# EasyEDA Pro project ProProject_OSC_Ver0.2_2023-11-09.epro, schematic MainBoard

## Sheets
1 Power: Create Date: 2023-09-10; Page Name: Power; Project Name: OSC_Ver0.2; Schematic Name: MainBoard; Update Date: 2023-11-07; Company: 嘉立创EDA; Page Size: A4; Version: V1.0
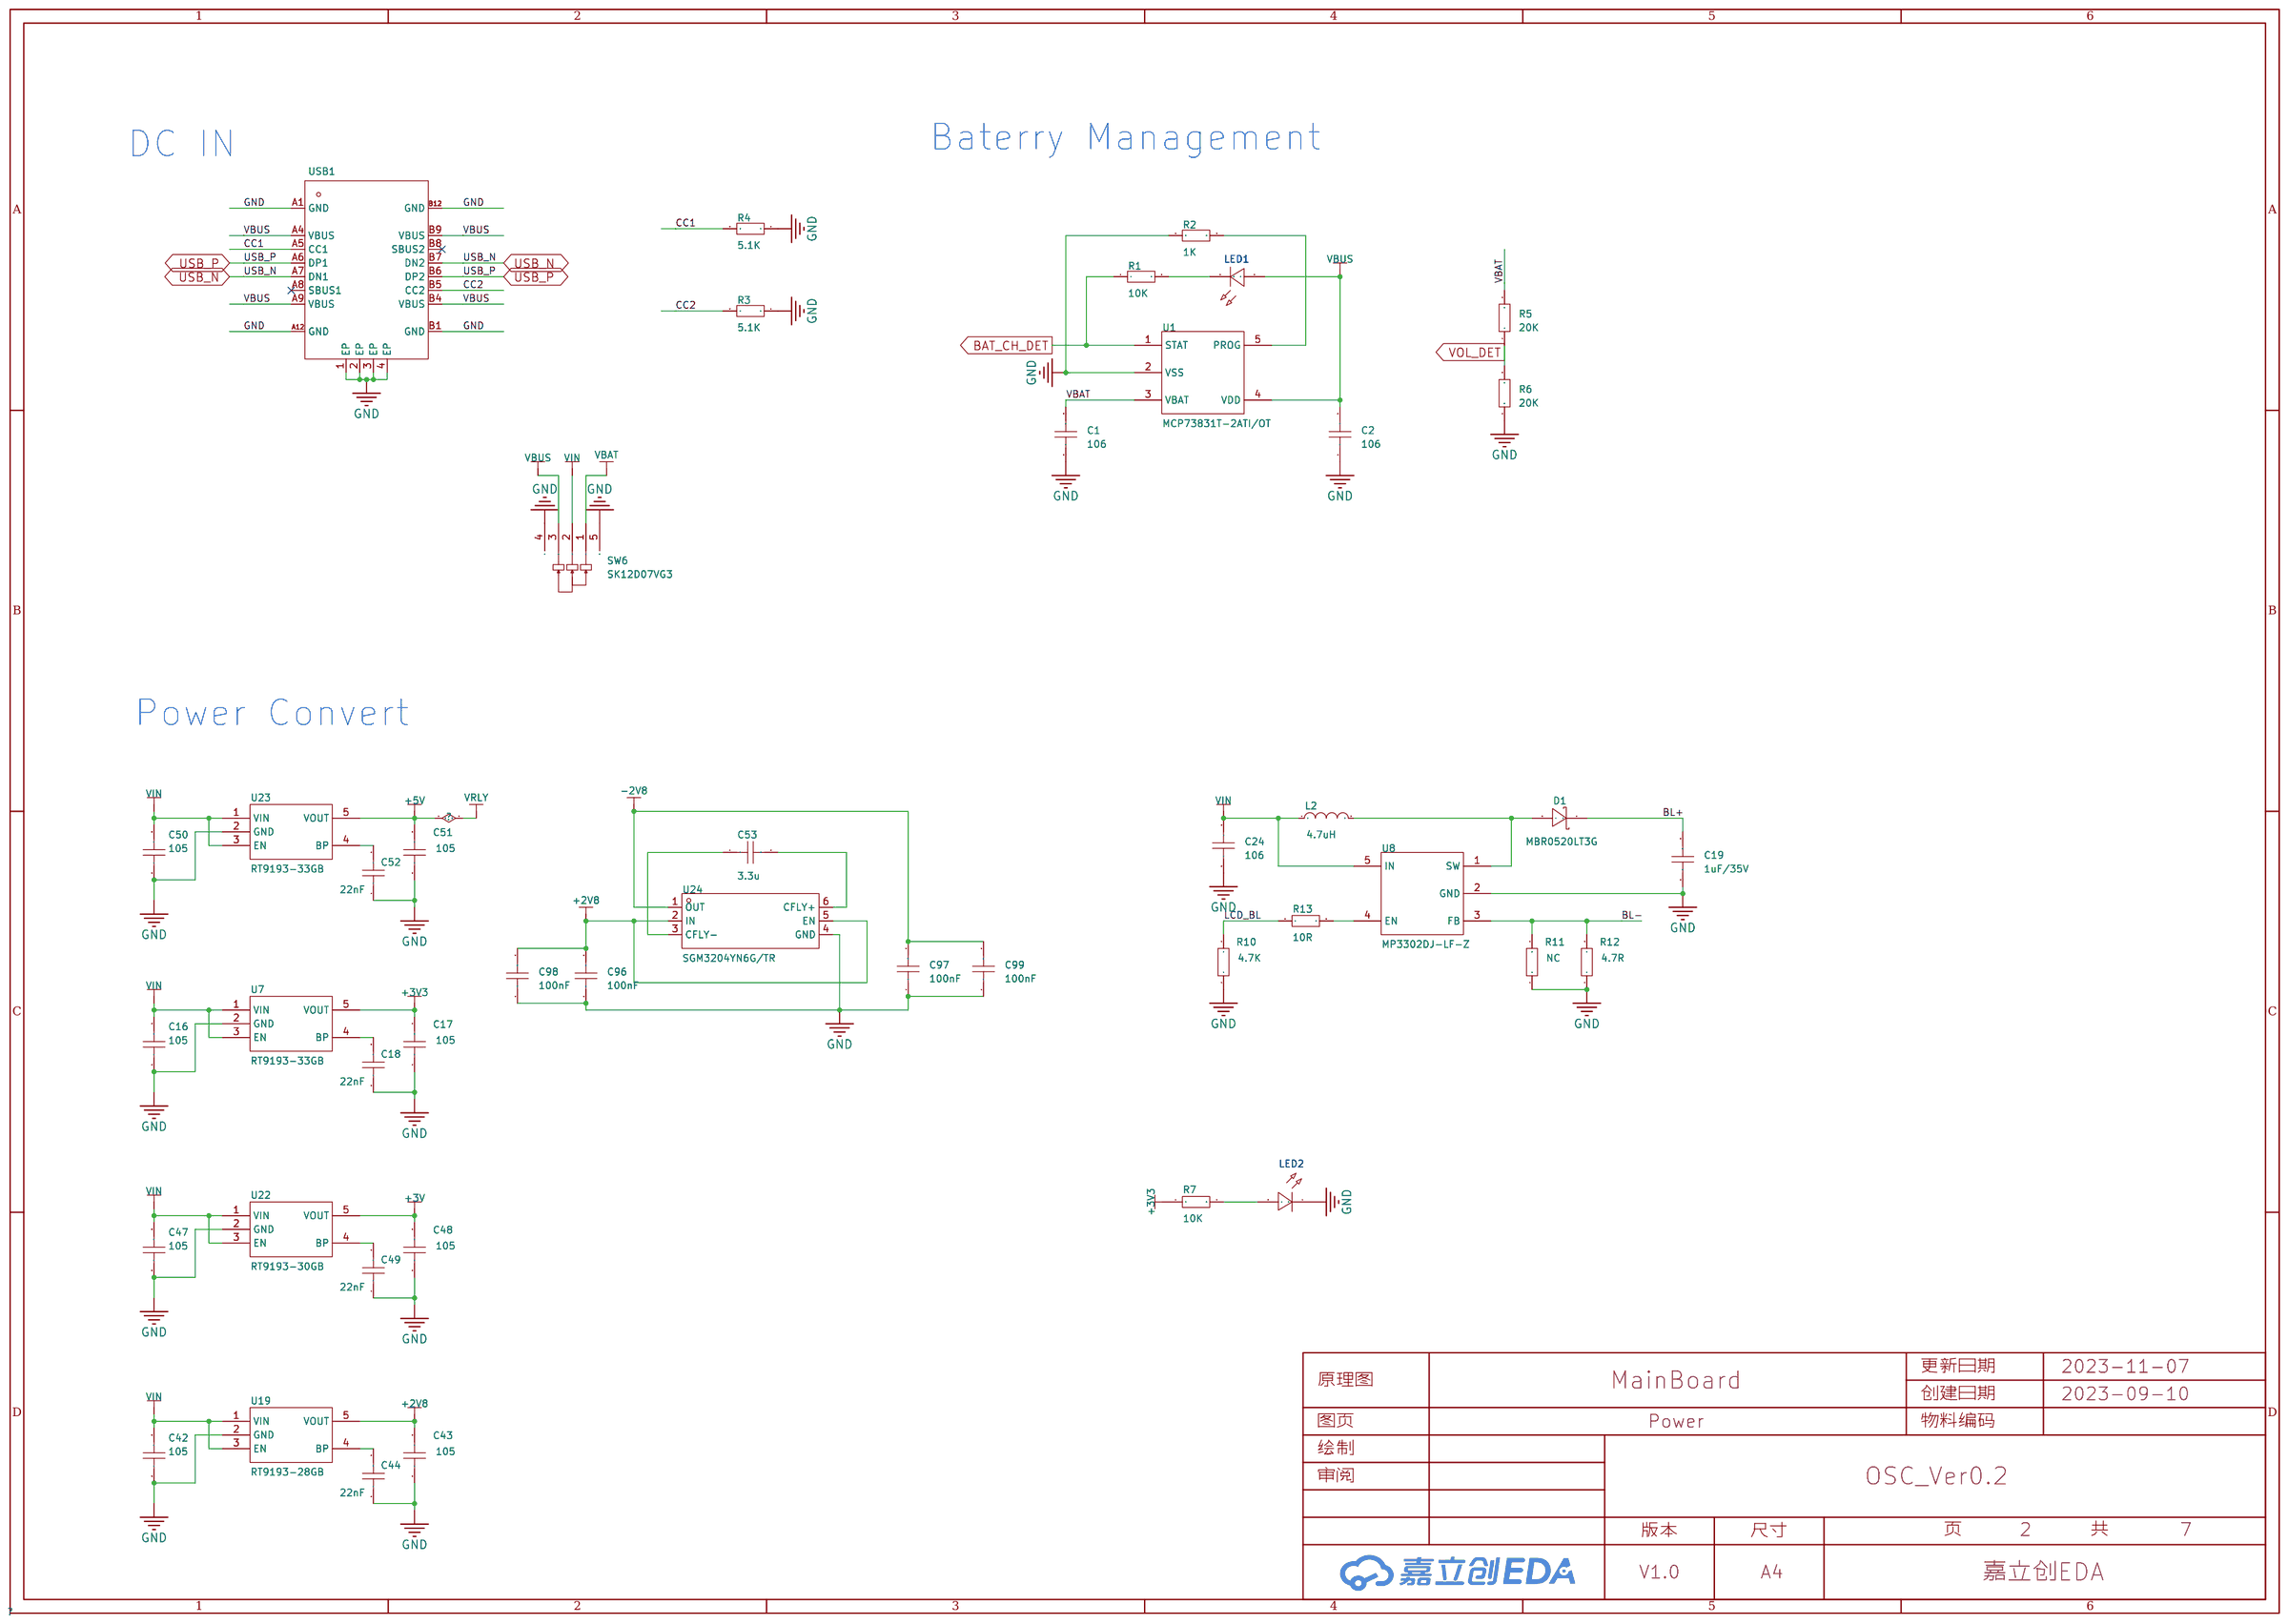
[diagram p1: Power]
2 MCU: Page Name: MCU; Page Size: A3
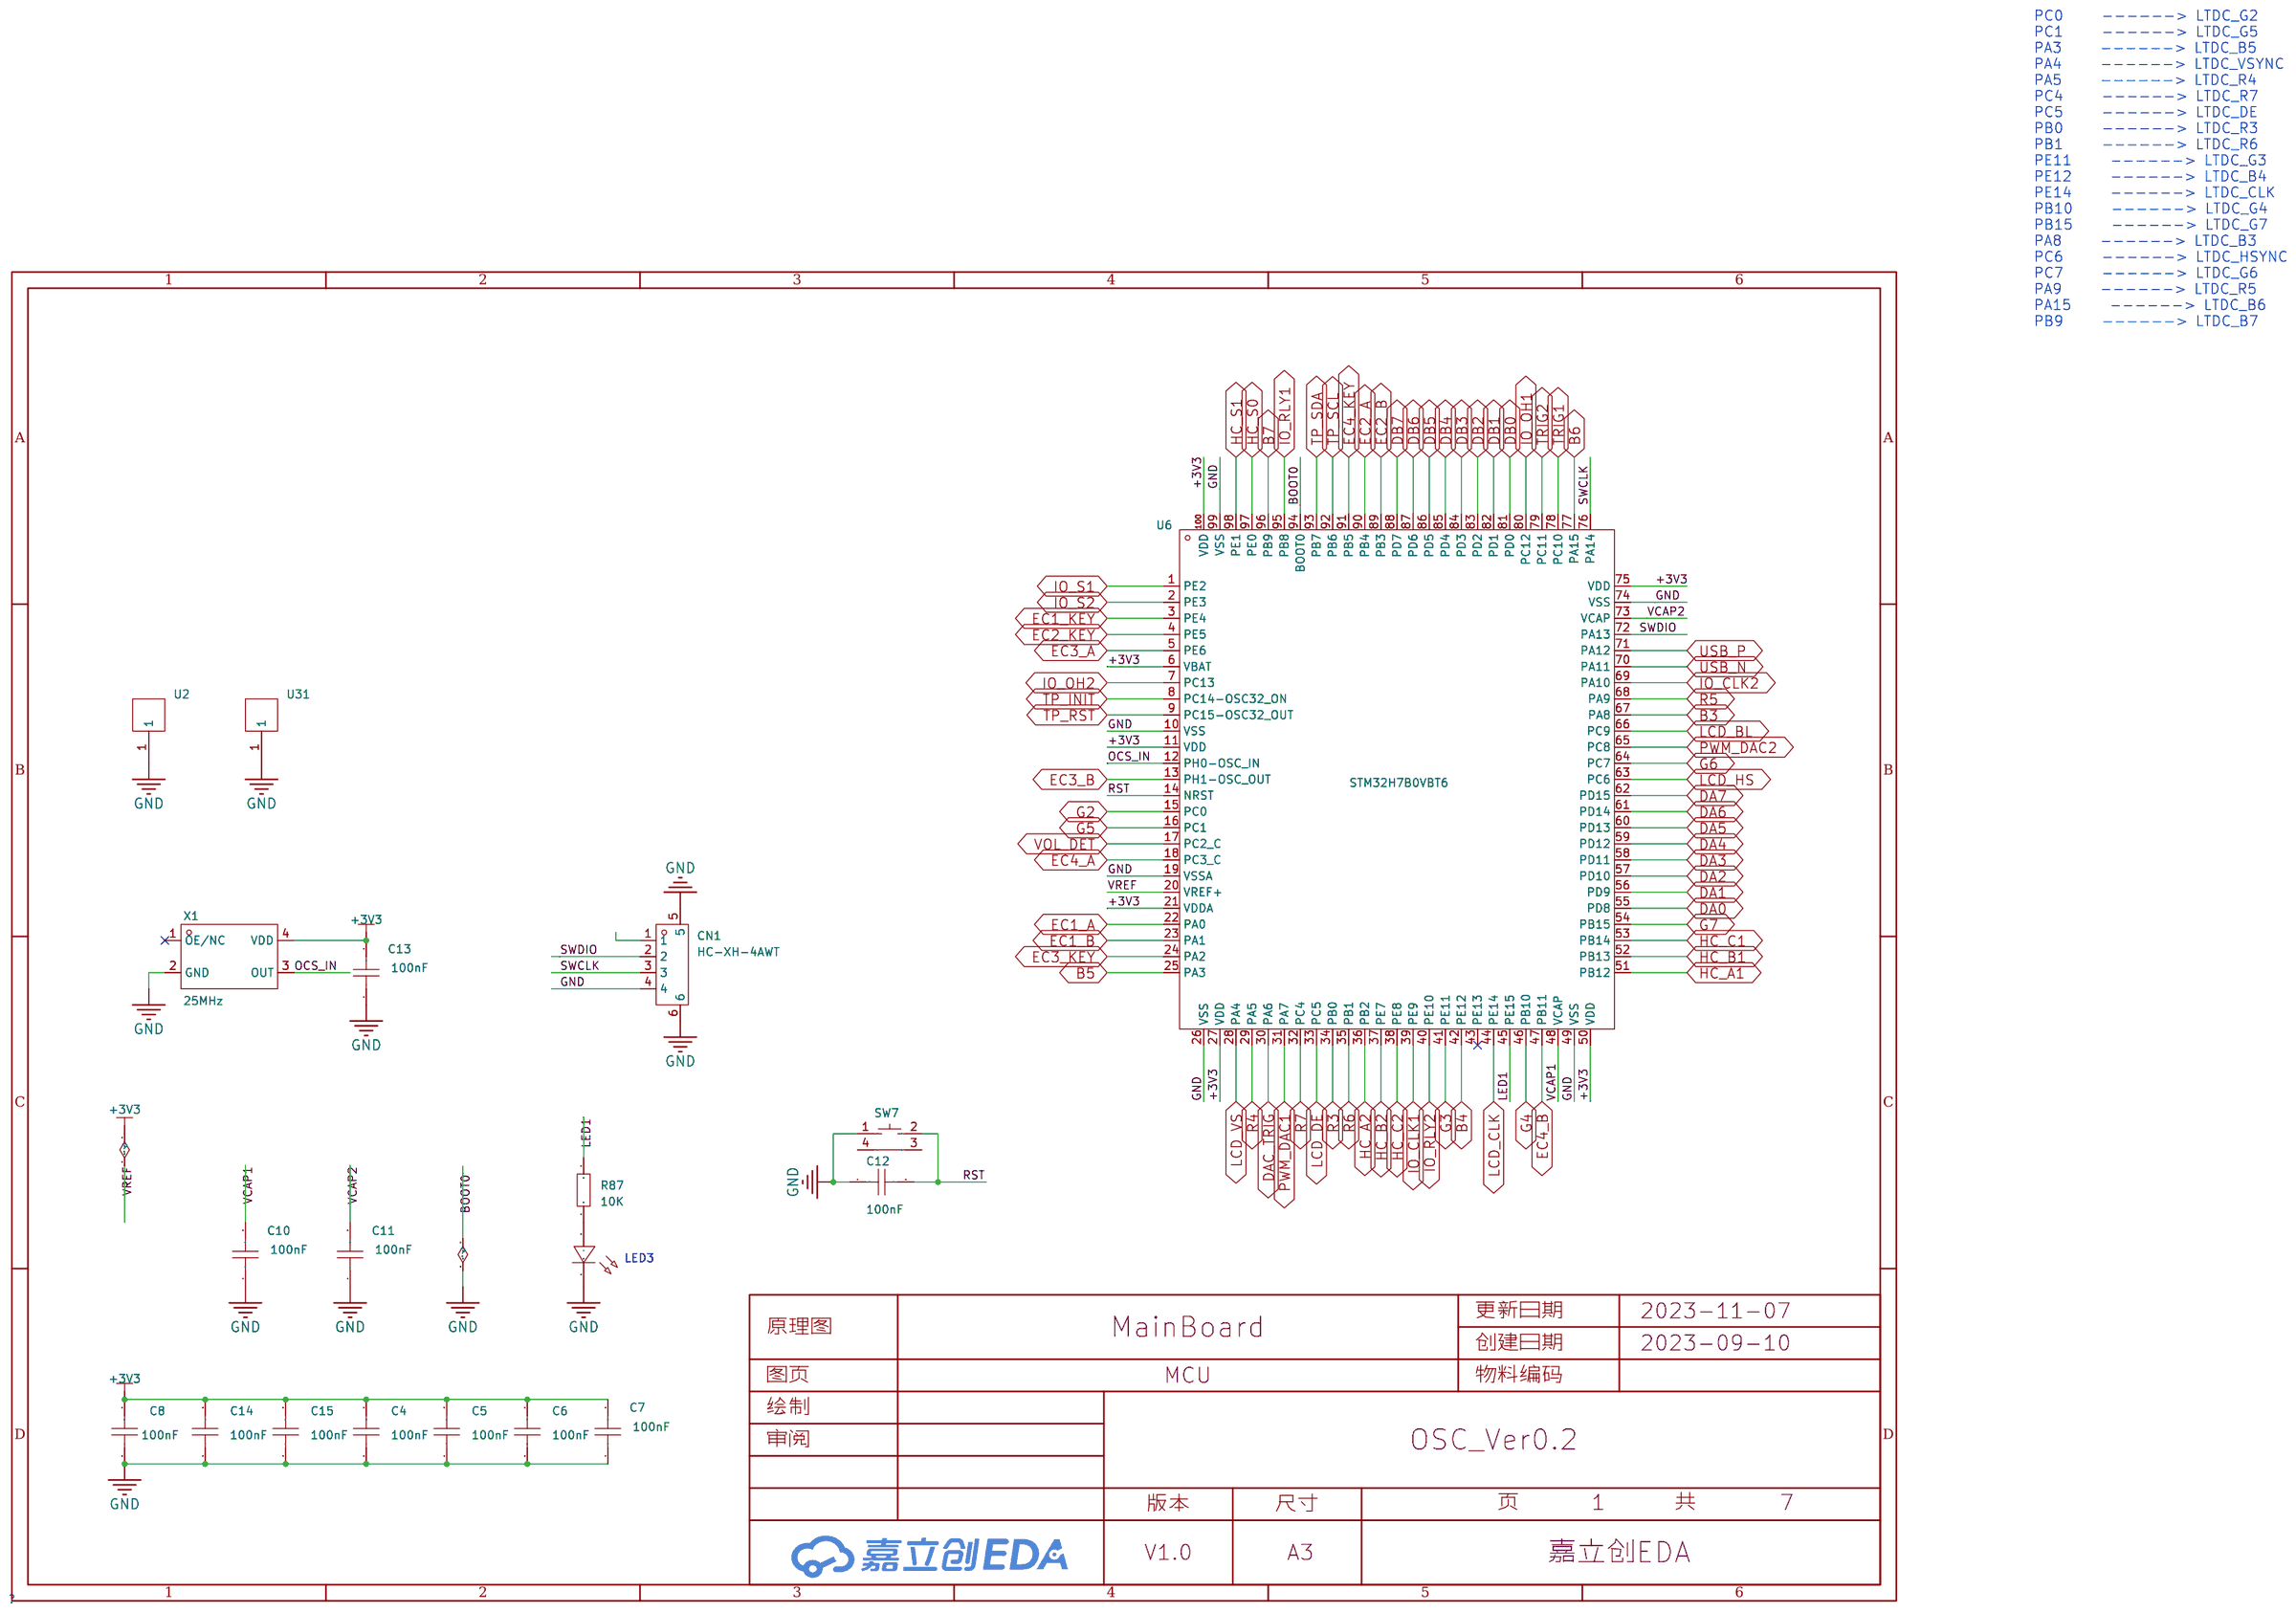
[diagram p2: MCU]
3 Screen: Create Date: 2023-09-18; Page Name: Screen; Update Date: 2023-10-18
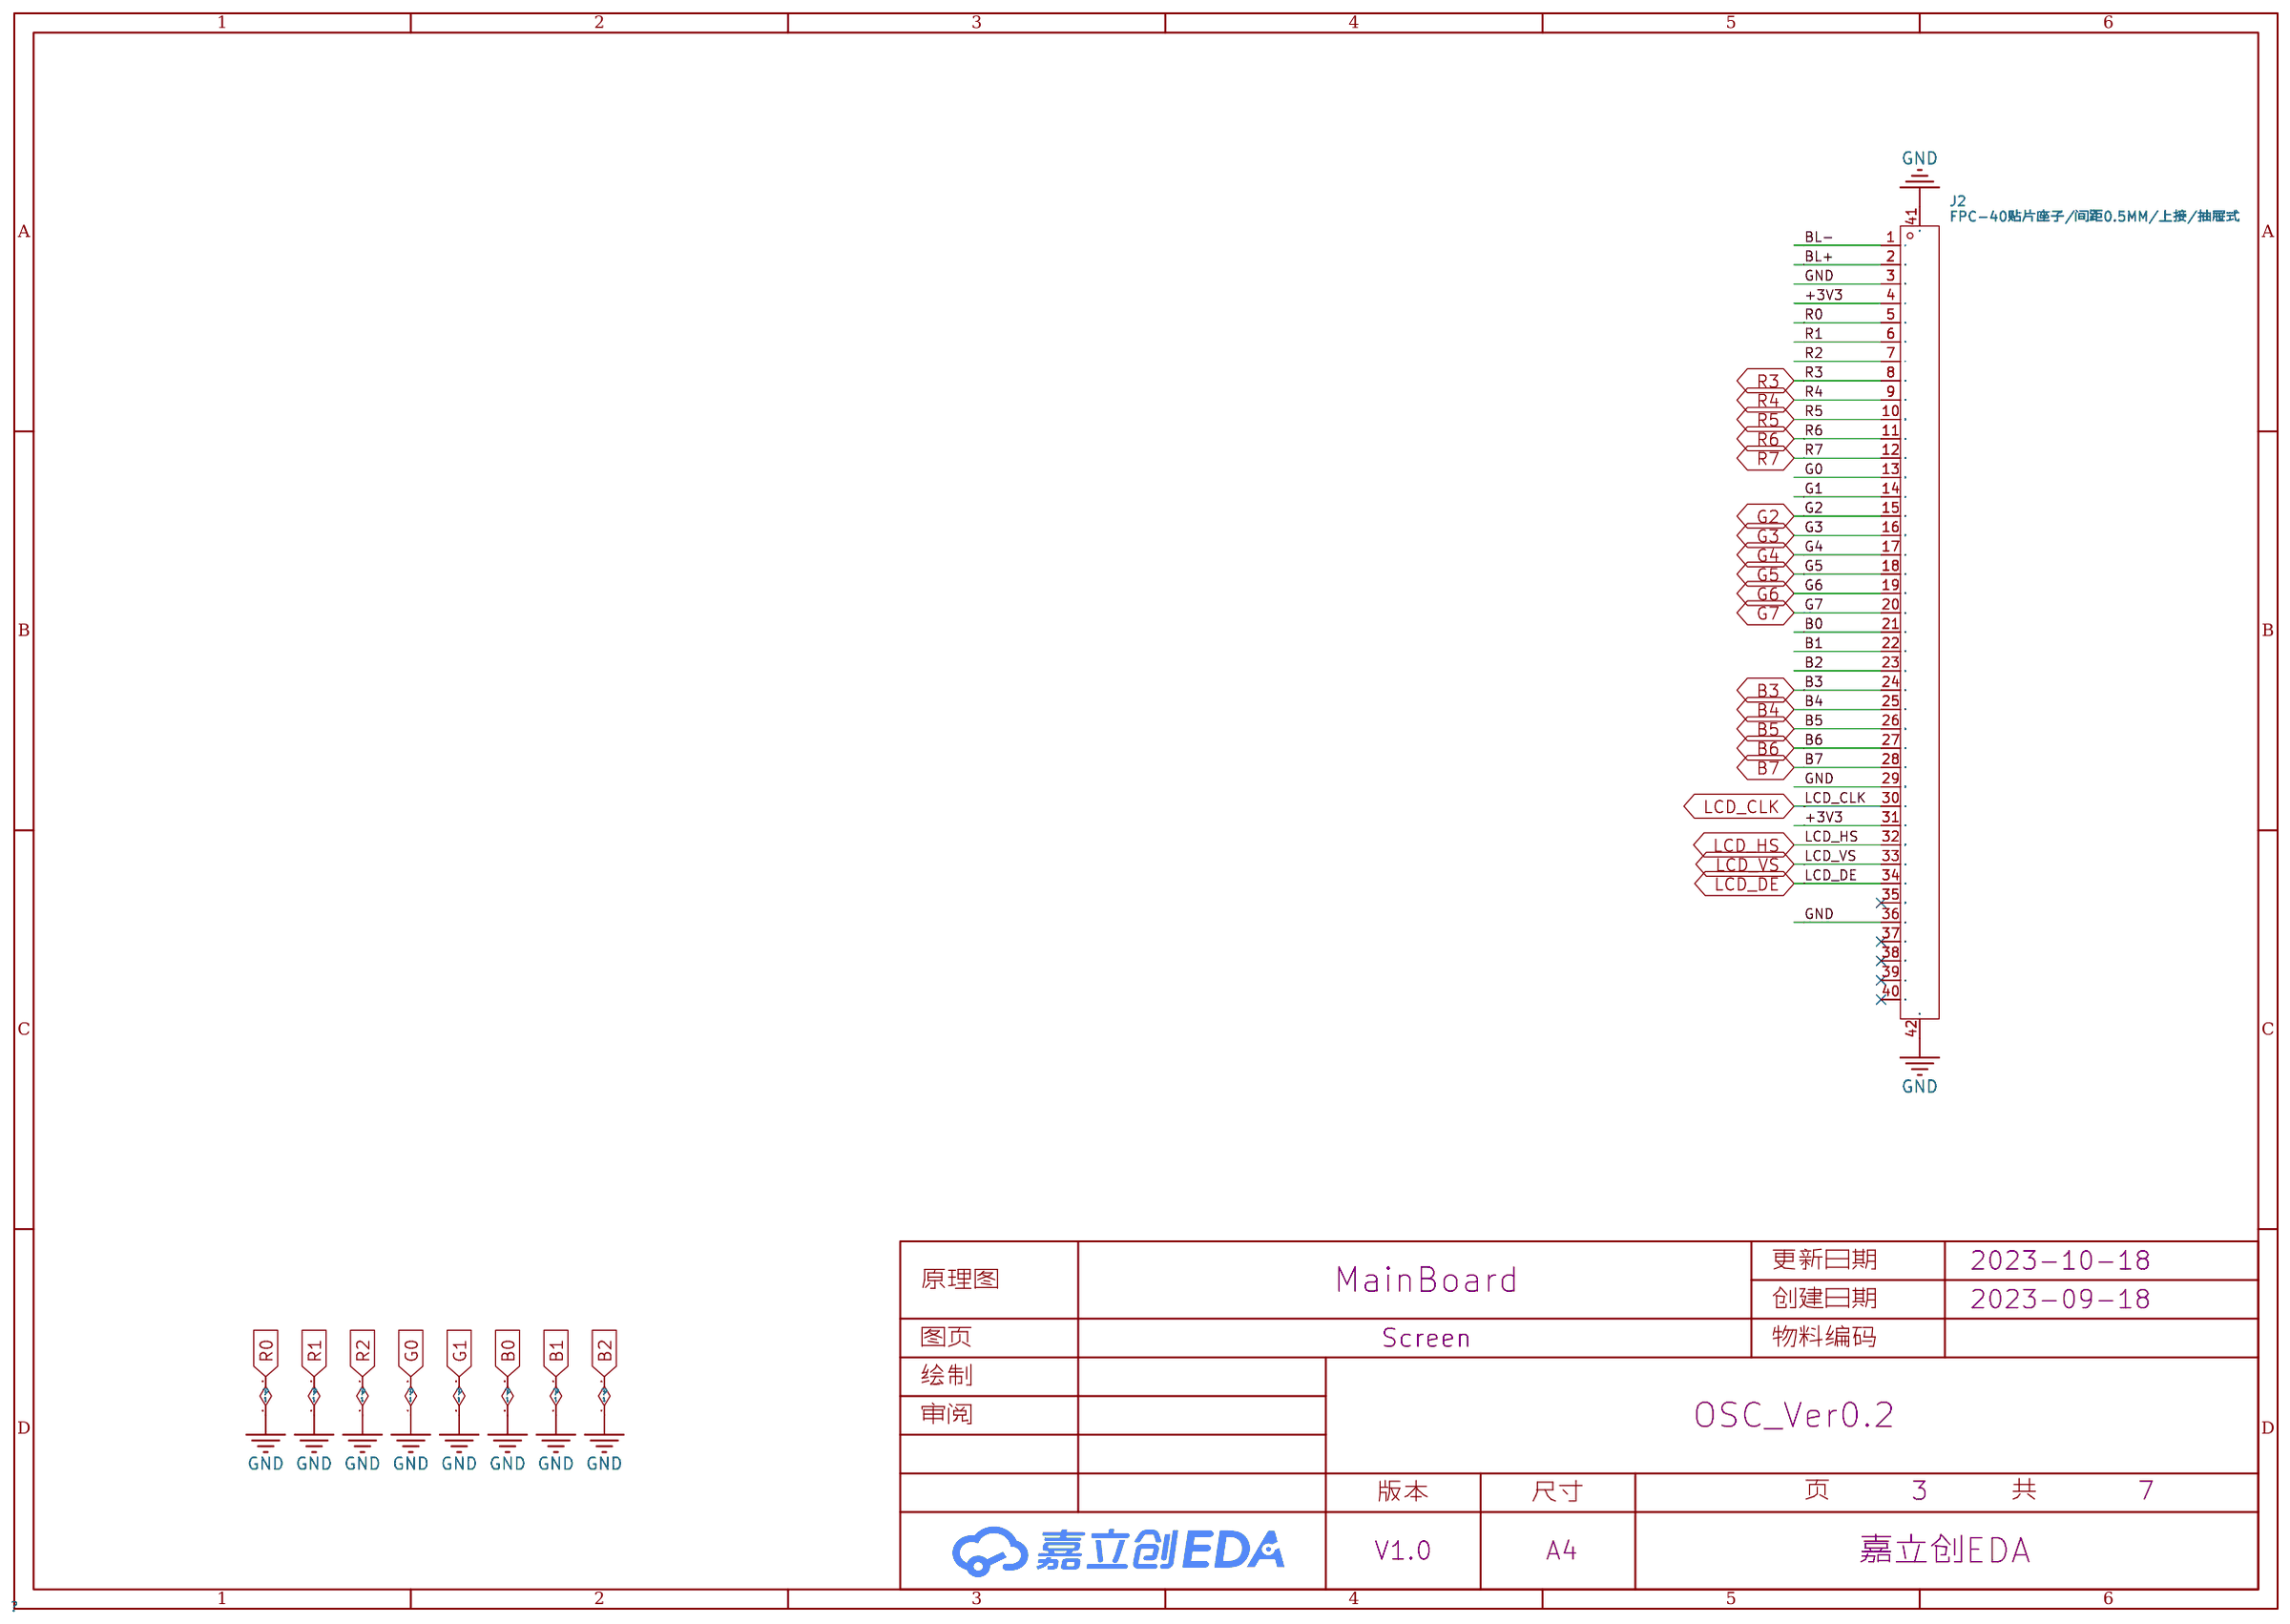
[diagram p3: Screen]
4 AnalogInput1: Create Date: 2023-10-07; Page Name: AnalogInput1
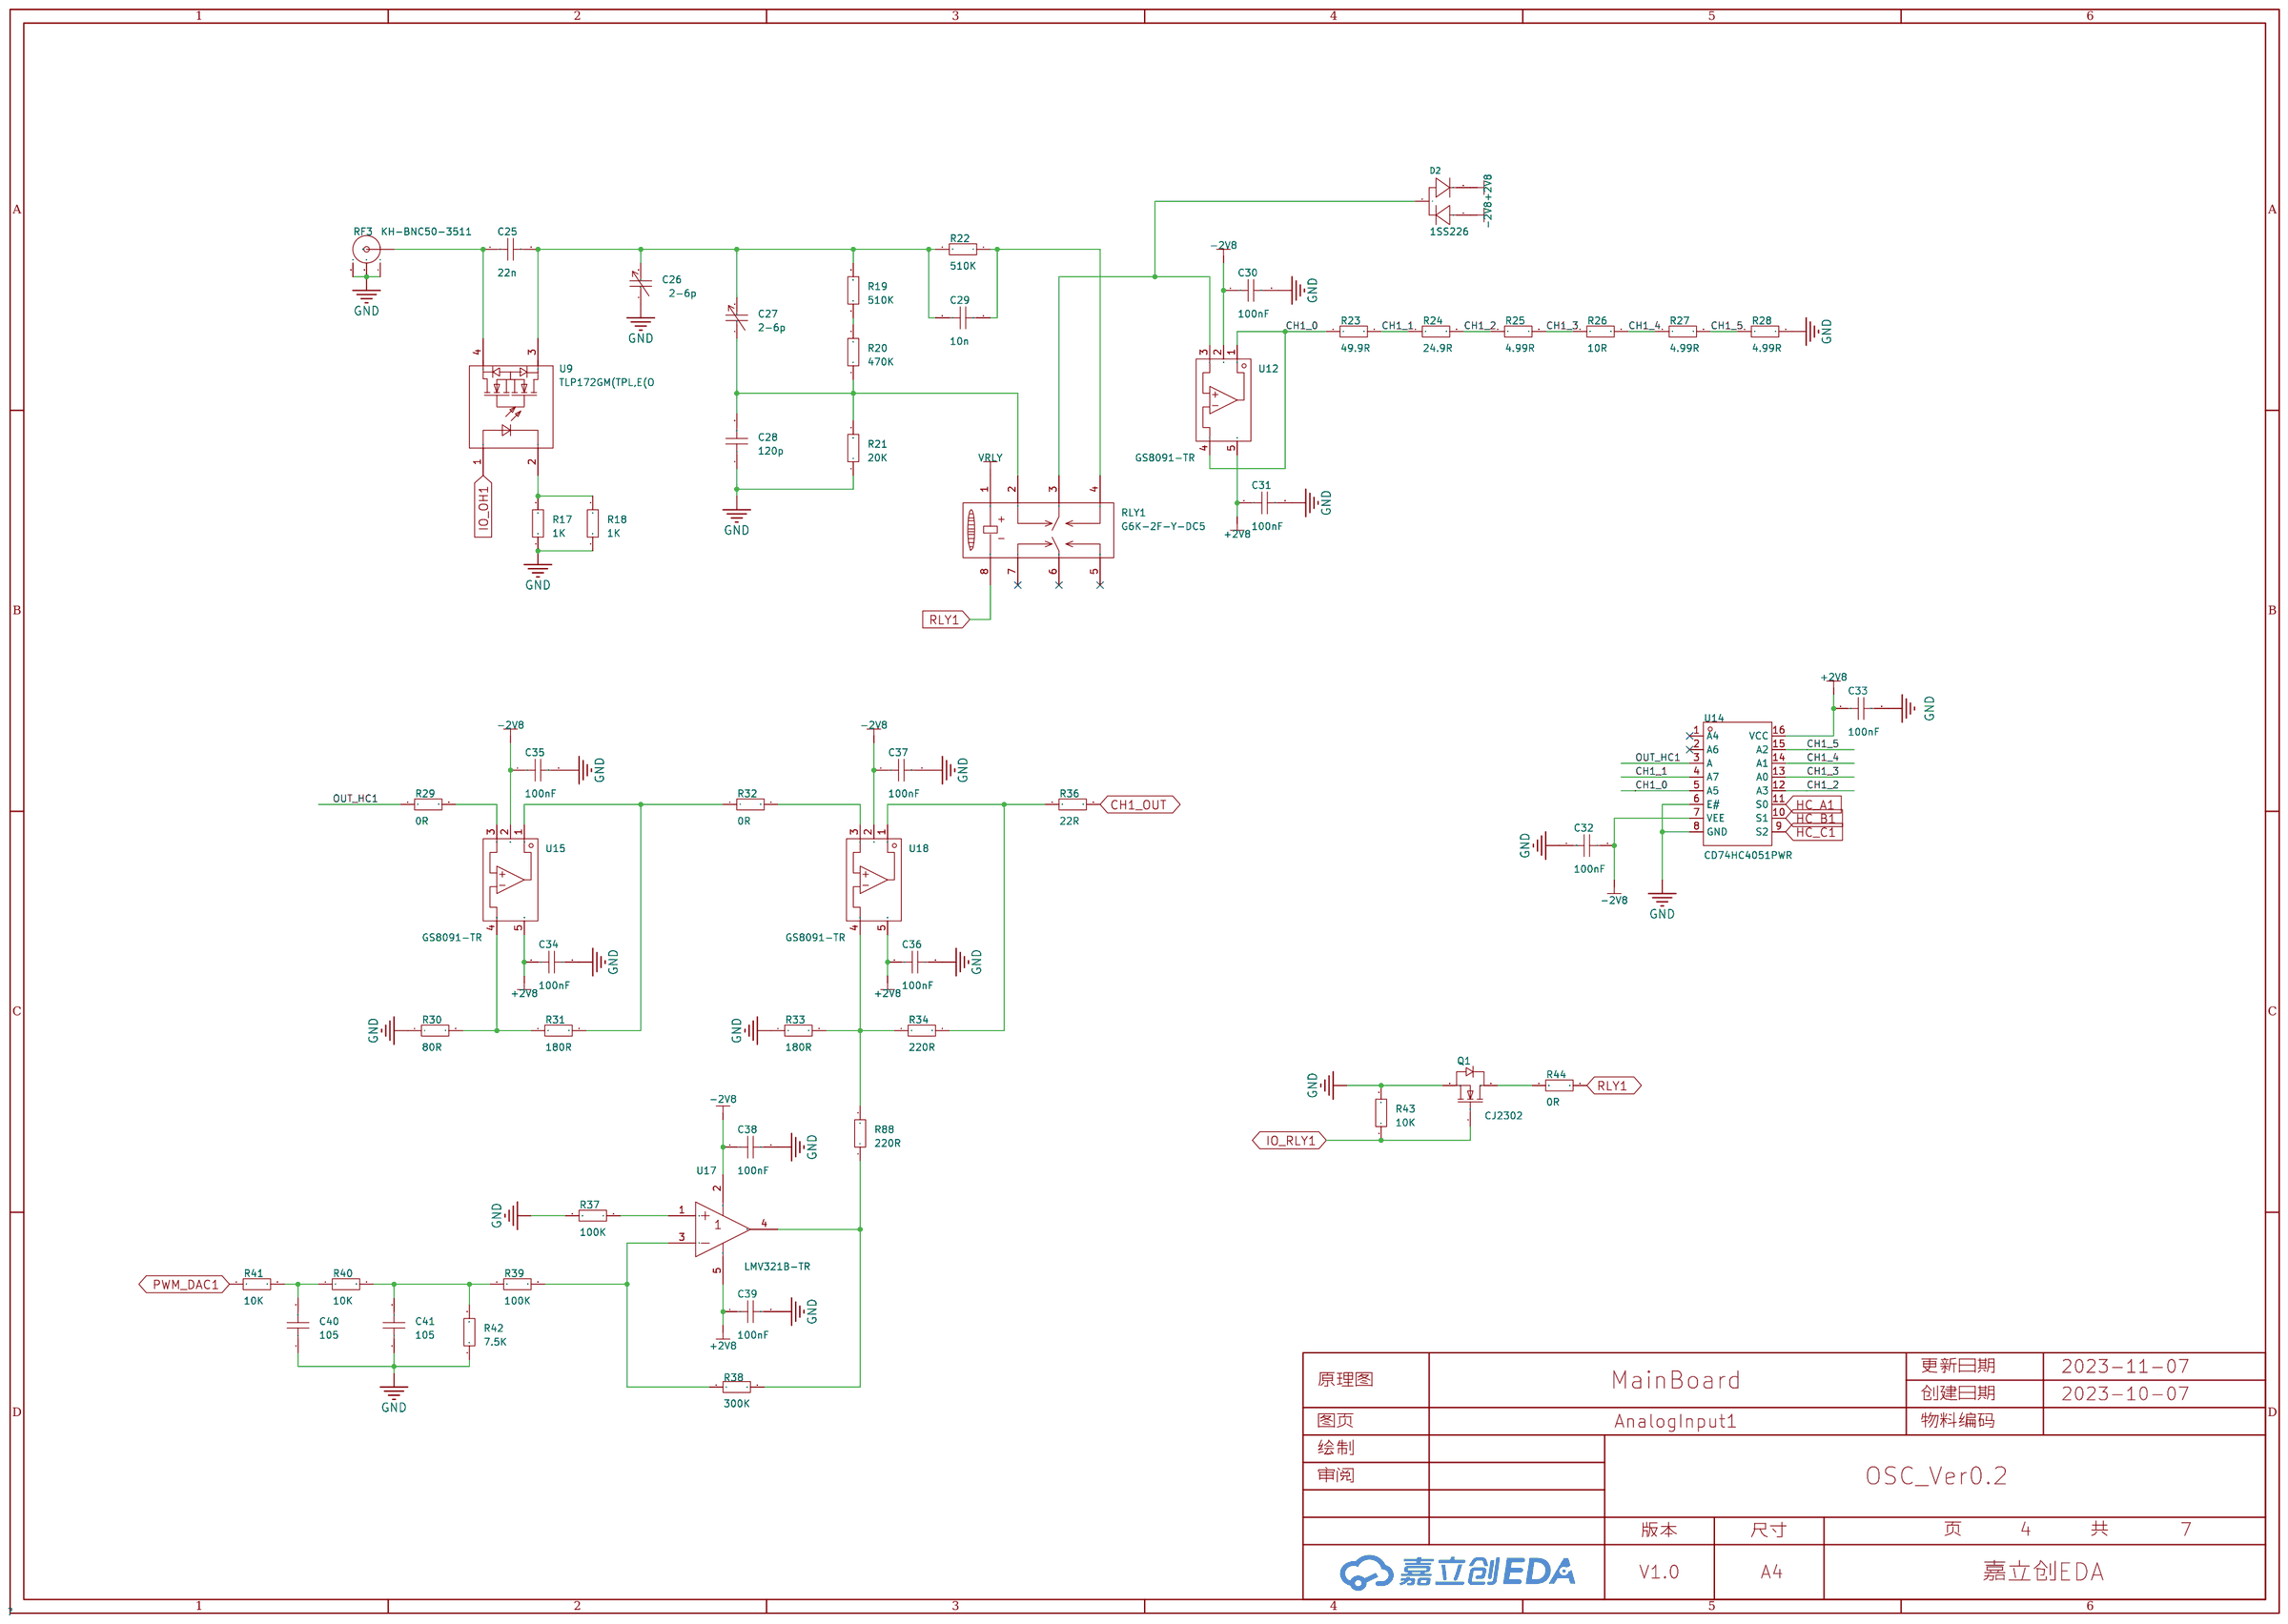
[diagram p4: AnalogInput1]
5 ADC: Create Date: 2023-10-13; Page Name: ADC; Update Date: 2023-10-18
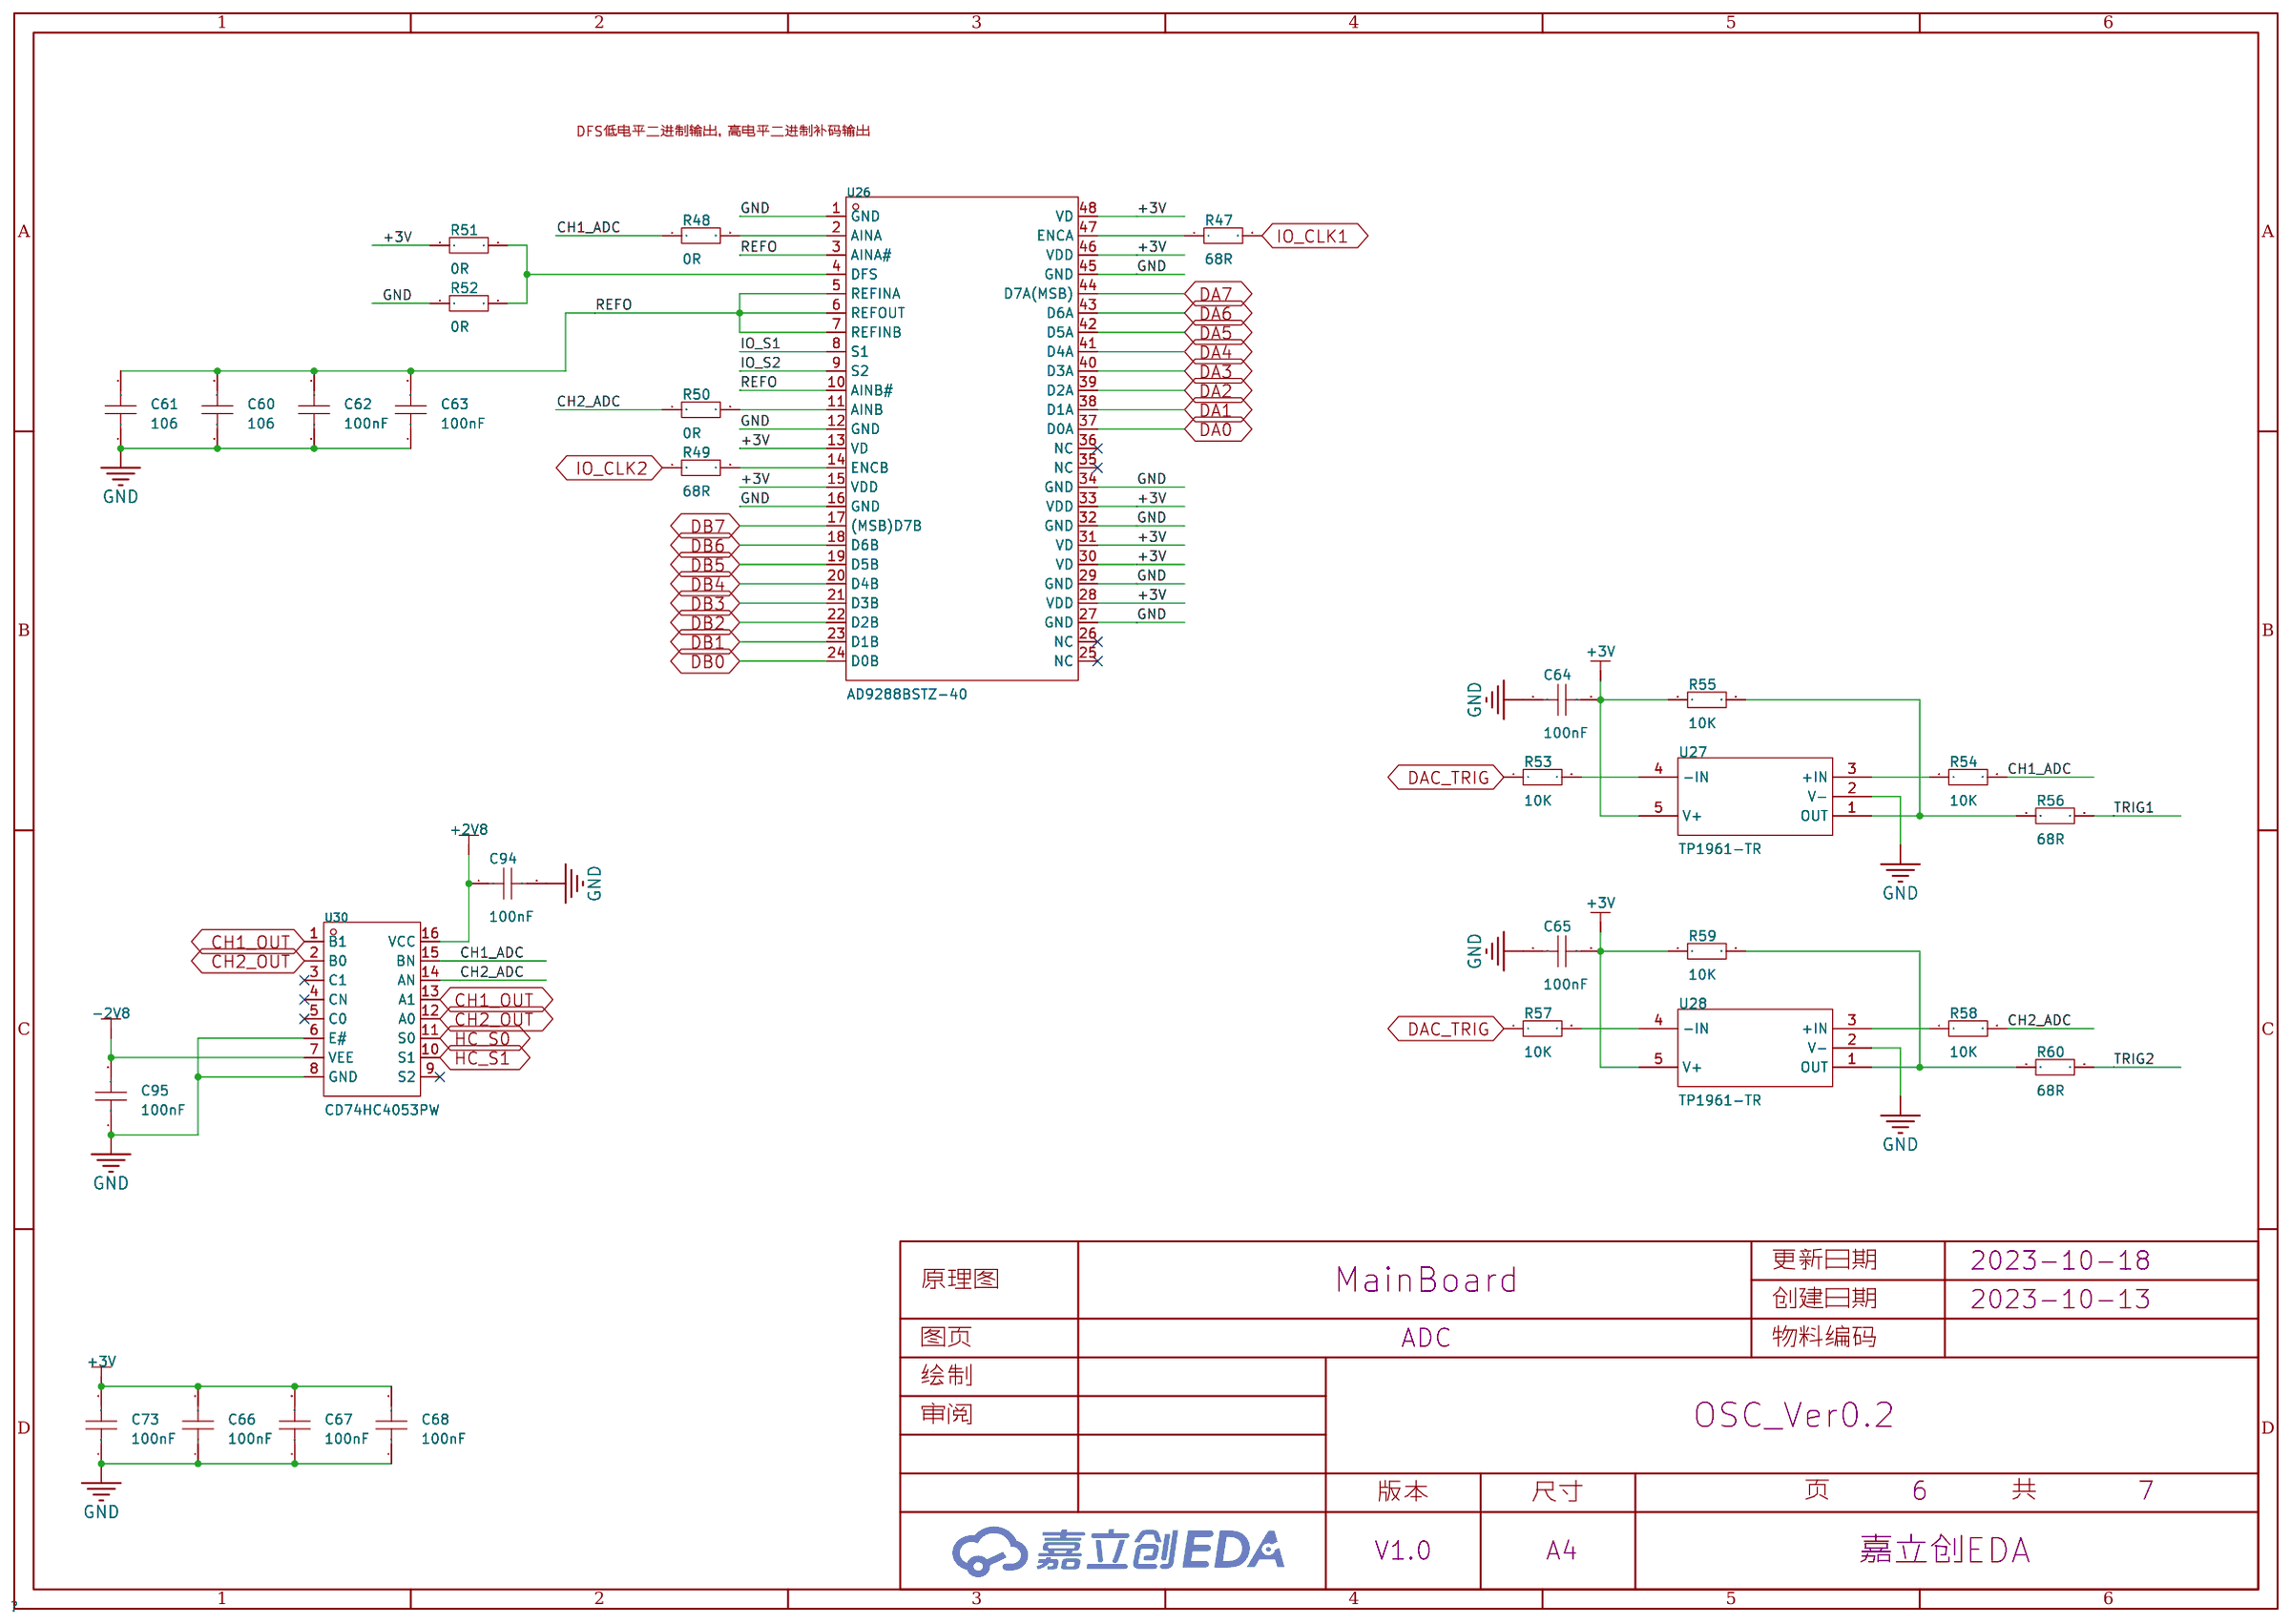
[diagram p5: ADC]
6 AnalogInput2: Create Date: 2023-10-13; Page Name: AnalogInput2
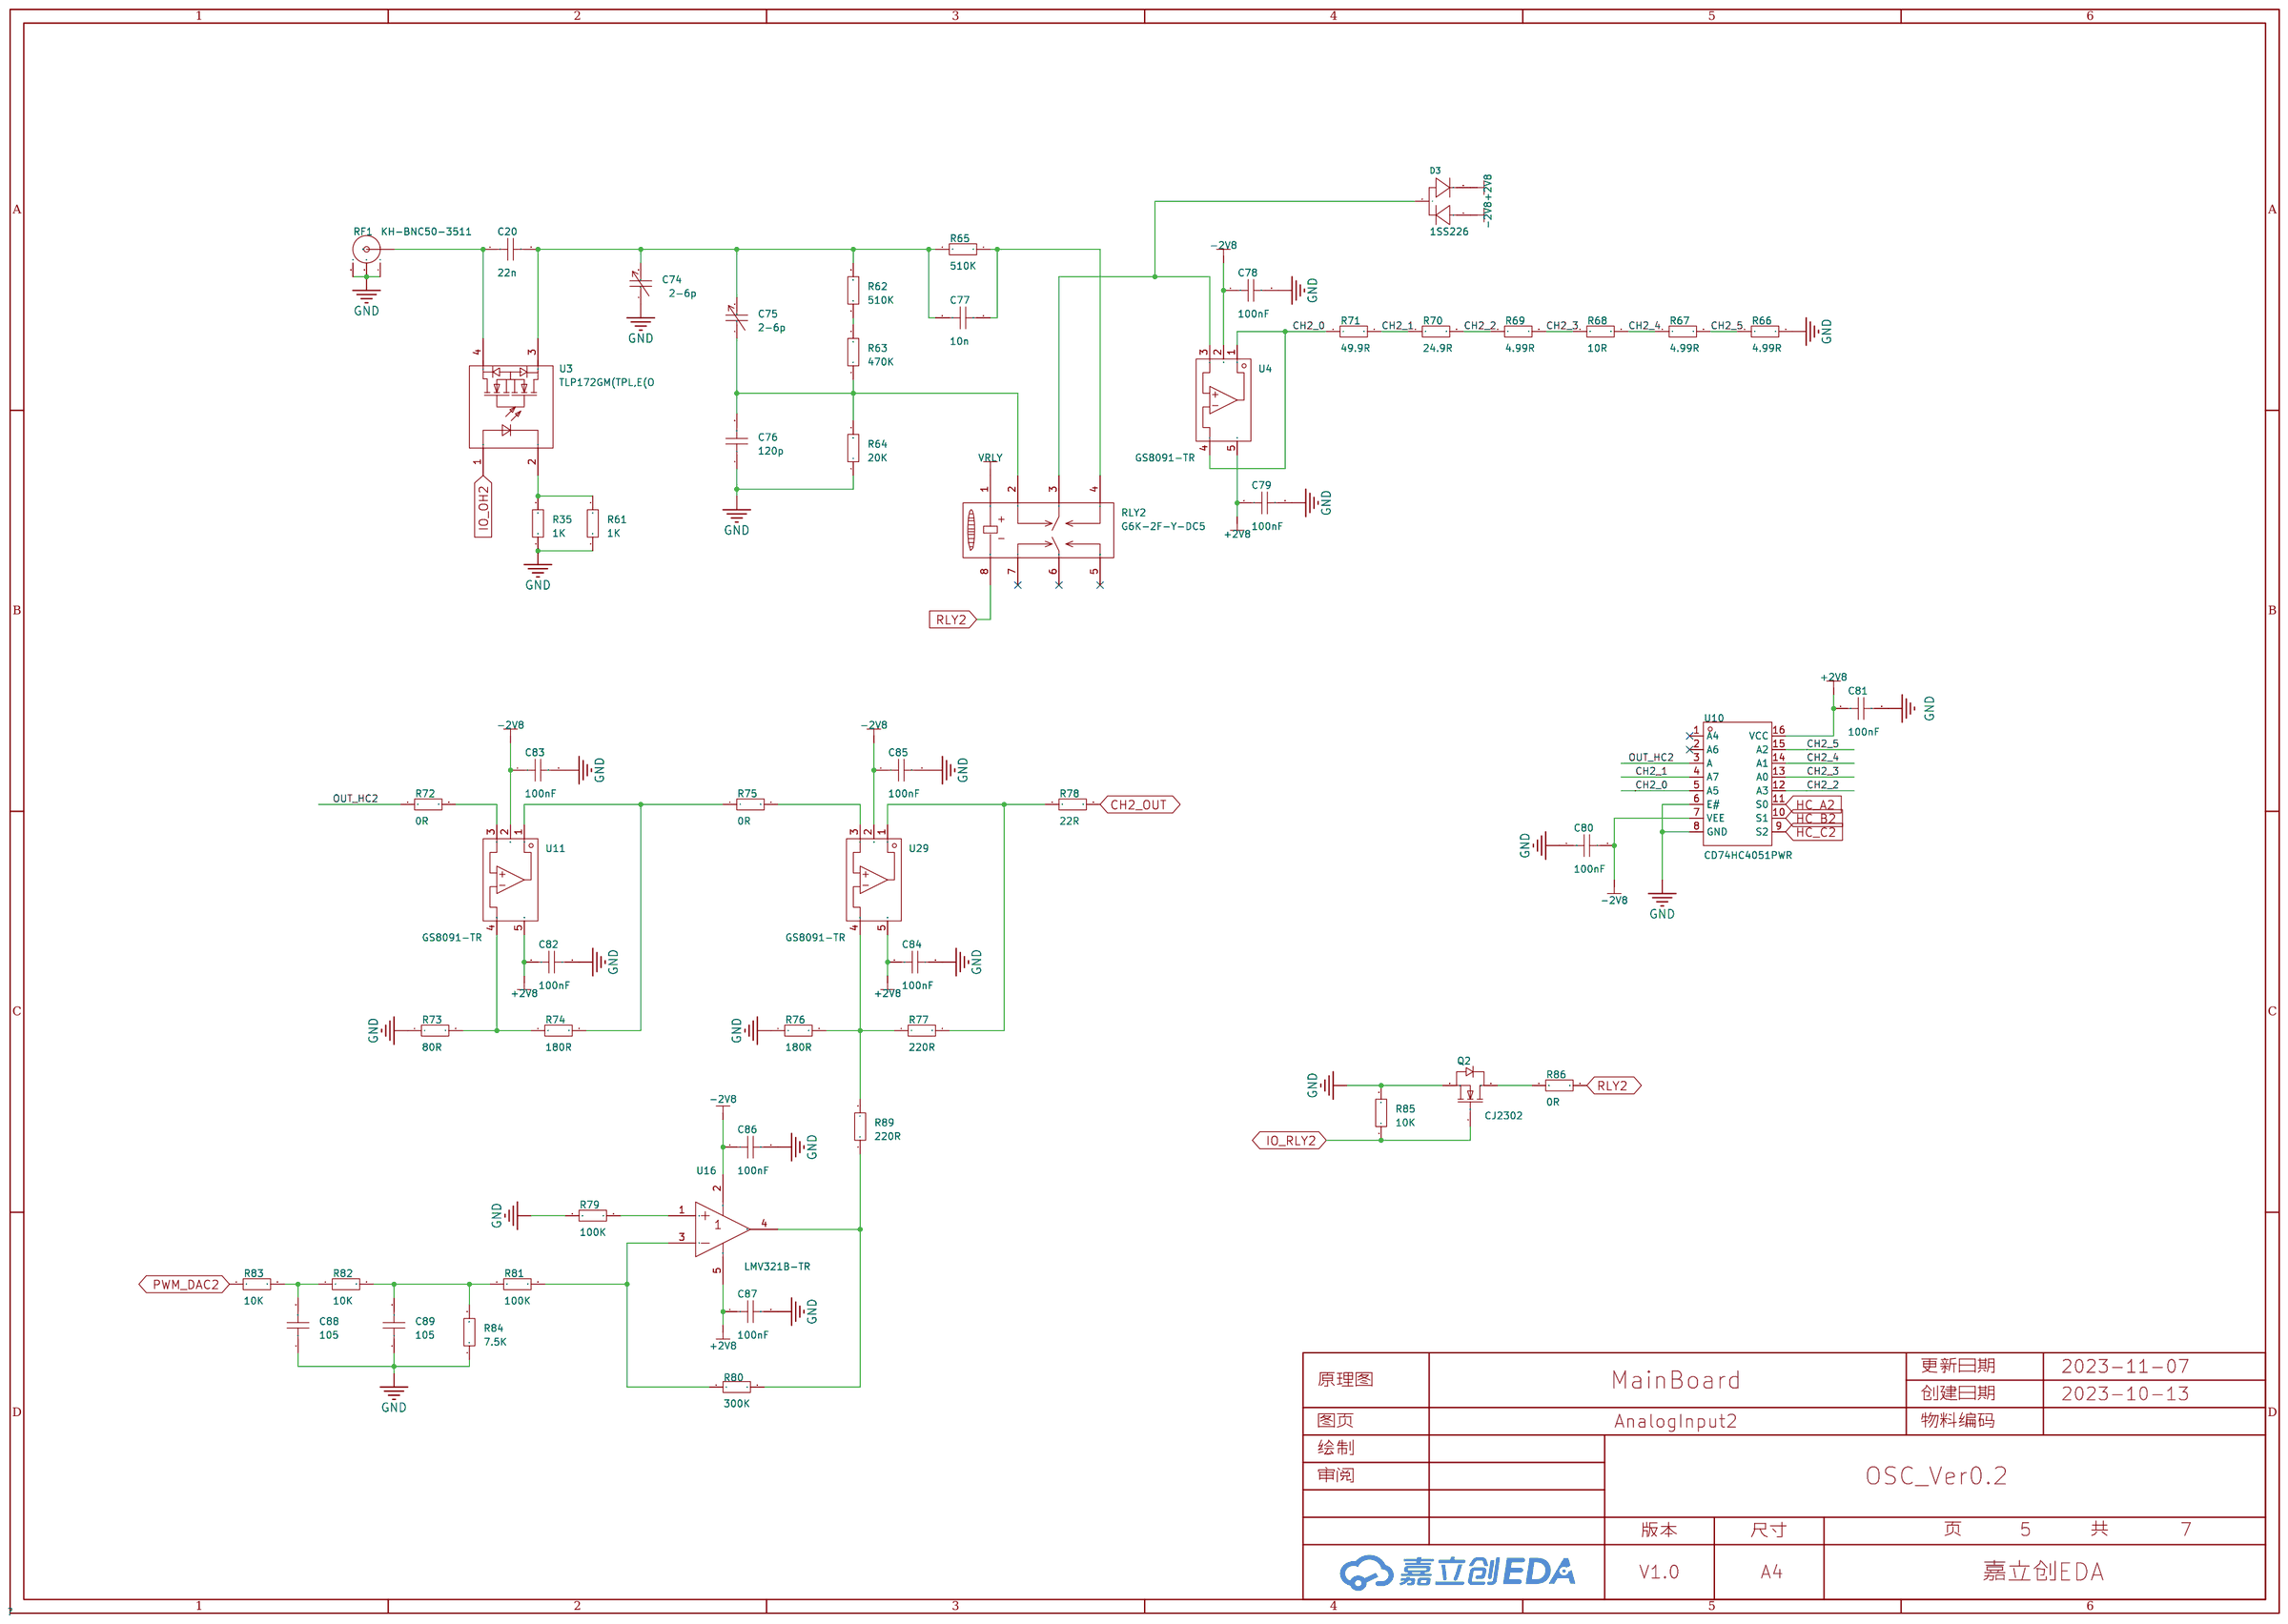
[diagram p6: AnalogInput2]
7 Linker: Create Date: 2023-10-18; Page Name: Linker.MainBoard; Update Date: 2023-10-18; Page Size: A5
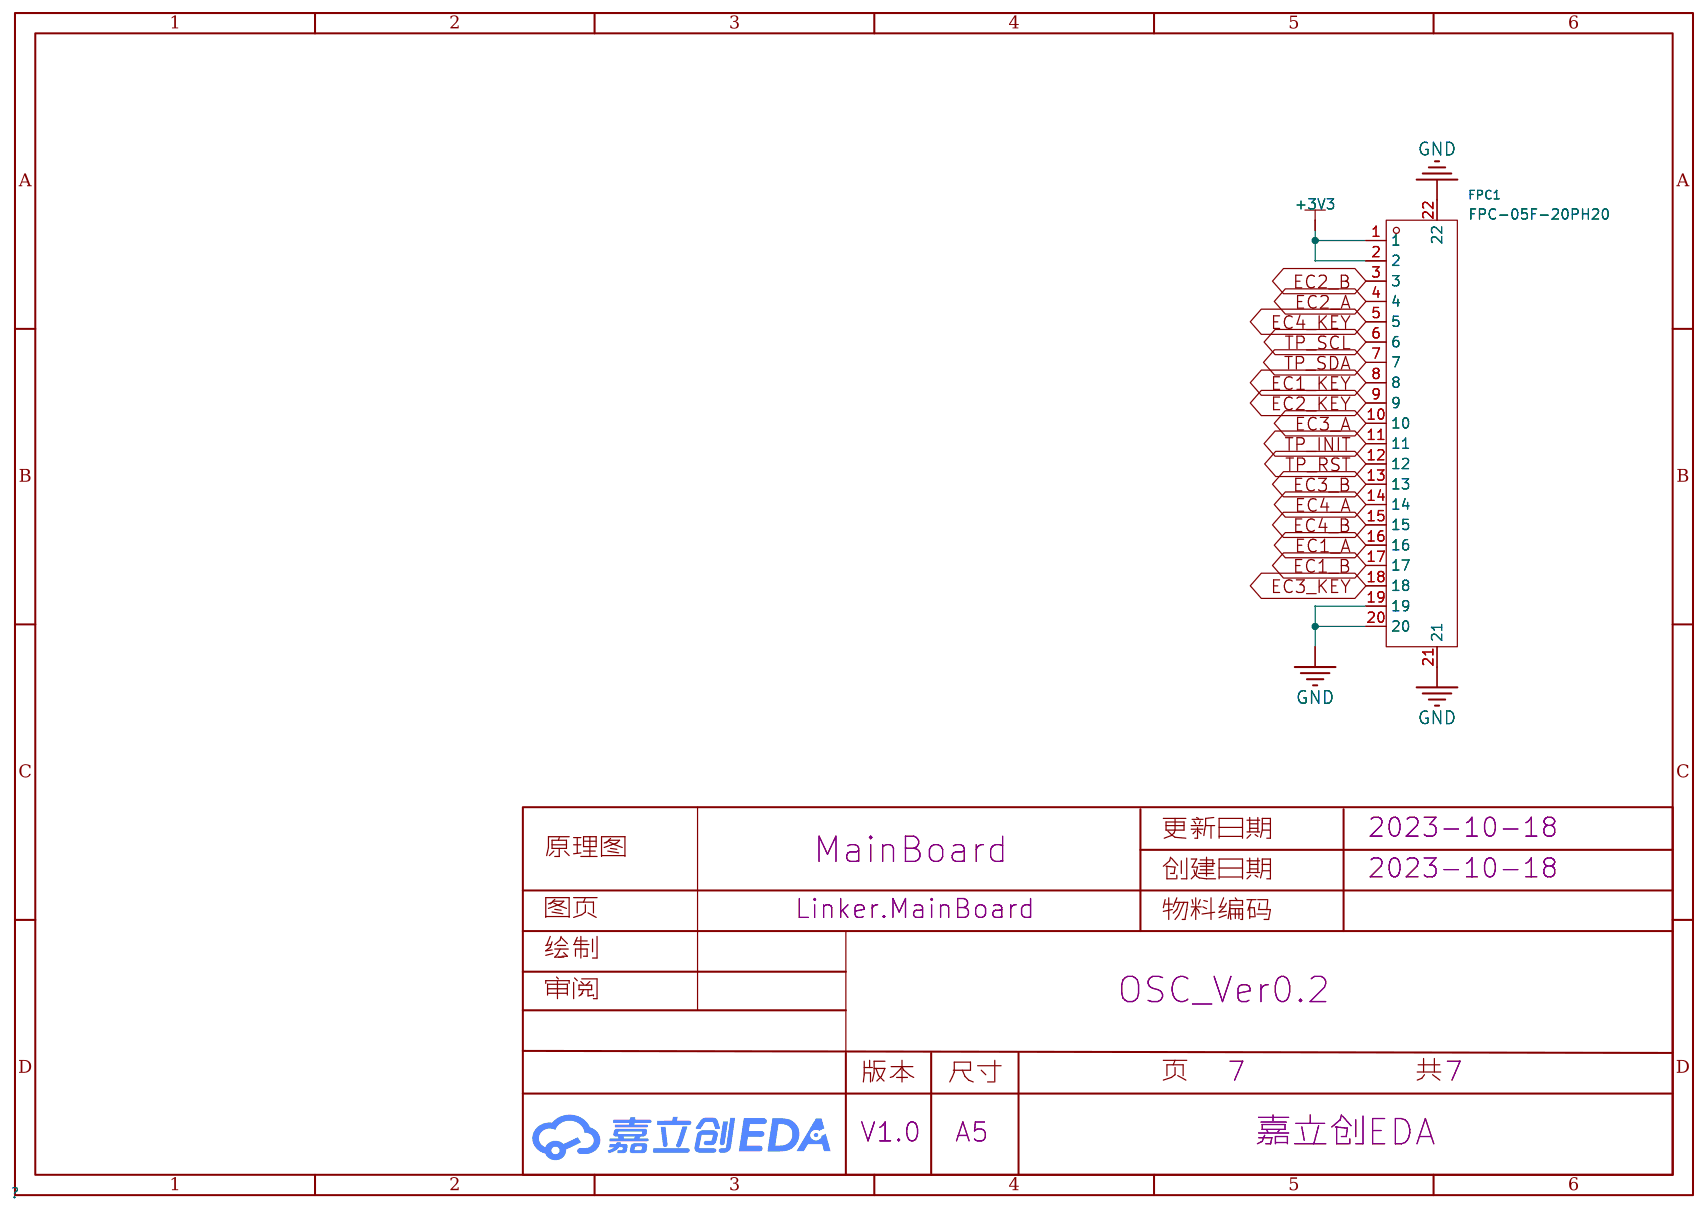
[diagram p7: Linker]

## Parts
sheet ADC
C60  106  [C1206]
C61  106  [C1206]
C62  100nF  [C0603]
C63  100nF  [C0603]
C64  100nF  [C0603]
C65  100nF  [C0603]
C66  100nF  [C0603]
C67  100nF  [C0603]
C68  100nF  [C0603]
C73  100nF  [C0603]
C94  100nF  [C0603]
C95  100nF  [C0603]
R47  68R  [R0603]
R48  0R  [R0603]
R49  68R  [R0603]
R50  0R  [R0603]
R51  0R  [R0603]
R52  0R  [R0603]
R53  10K  [R0603]
R54  10K  [R0603]
R55  10K  [R0603]
R56  68R  [R0603]
R57  10K  [R0603]
R58  10K  [R0603]
R59  10K  [R0603]
R60  68R  [R0603]
U26  AD9288BSTZ-40  [LQFP-48_L7.0-W7.0-P0.50-LS9.0-BL]
U27  TP1961-TR  [SOT-23-5_L3.0-W1.7-P0.95-LS2.8-BR]
U28  TP1961-TR  [SOT-23-5_L3.0-W1.7-P0.95-LS2.8-BR]
U30  CD74HC4053PW  [TSSOP-16_L5.0-W4.4-P0.65-LS6.4-BL]
sheet AnalogInput1
C25  22n  [C1206]
C26  2-6p  [CAP-ADJ-SMD_L4.5-W3.2-L]
C27  2-6p  [CAP-ADJ-SMD_L4.5-W3.2-L]
C28  120p  [C0603]
C29  10n  [C0603]
C30  100nF  [C0603]
C31  100nF  [C0603]
C32  100nF  [C0603]
C33  100nF  [C0603]
C34  100nF  [C0603]
C35  100nF  [C0603]
C36  100nF  [C0603]
C37  100nF  [C0603]
C38  100nF  [C0603]
C39  100nF  [C0603]
C40  105  [C0603]
C41  105  [C0603]
D2  1SS226  [SOT-23-3_L2.9-W1.3-P1.90-LS2.4-BL-2]
Q1  CJ2302  [SOT-23-3_L2.9-W1.3-P1.90-LS2.4-BR]
R17  1K  [R0603]
R18  1K  [R0603]
R19  510K  [R0603]
R20  470K  [R0603]
R21  20K  [R0603]
R22  510K  [R0603]
R23  49.9R  [R0603]
R24  24.9R  [R0603]
R25  4.99R  [R0603]
R26  10R  [R0603]
R27  4.99R  [R0603]
R28  4.99R  [R0603]
R29  0R  [R0603]
R30  80R  [R0603]
R31  180R  [R0603]
R32  0R  [R0603]
R33  180R  [R0603]
R34  220R  [R0603]
R36  22R  [R0603]
R37  100K  [R0603]
R38  300K  [R0603]
R39  100K  [R0603]
R40  10K  [R0603]
R41  10K  [R0603]
R42  7.5K  [R0603]
R43  10K  [R0603]
R44  0R  [R0603]
R88  220R  [R0603]
RF3  KH-BNC50-3511  [ANT-TH_KH-BNC50-3511]
RLY1  G6K-2F-Y-DC5  [RELAY-SMD_G6K-2F-Y]
U9  TLP172GM(TPL,E(O  [SMD-4_L4.6-W3.7-P2.54-LS7.0-BR]
U12  GS8091-TR  [SOT-23-5_L3.0-W1.7-P0.95-LS2.8-BR]
U14  CD74HC4051PWR  [TSSOP-16_L5.0-W4.4-P0.65-LS6.4-BL]
U15  GS8091-TR  [SOT-23-5_L3.0-W1.7-P0.95-LS2.8-BR]
U17  LMV321B-TR  [SOT-23-5_L3.0-W1.7-P0.95-LS2.8-BR]
U18  GS8091-TR  [SOT-23-5_L3.0-W1.7-P0.95-LS2.8-BR]
sheet AnalogInput2
C20  22n  [C1206]
C74  2-6p  [CAP-ADJ-SMD_L4.5-W3.2-L]
C75  2-6p  [CAP-ADJ-SMD_L4.5-W3.2-L]
C76  120p  [C0603]
C77  10n  [C0603]
C78  100nF  [C0603]
C79  100nF  [C0603]
C80  100nF  [C0603]
C81  100nF  [C0603]
C82  100nF  [C0603]
C83  100nF  [C0603]
C84  100nF  [C0603]
C85  100nF  [C0603]
C86  100nF  [C0603]
C87  100nF  [C0603]
C88  105  [C0603]
C89  105  [C0603]
D3  1SS226  [SOT-23-3_L2.9-W1.3-P1.90-LS2.4-BL-2]
Q2  CJ2302  [SOT-23-3_L2.9-W1.3-P1.90-LS2.4-BR]
R35  1K  [R0603]
R61  1K  [R0603]
R62  510K  [R0603]
R63  470K  [R0603]
R64  20K  [R0603]
R65  510K  [R0603]
R66  4.99R  [R0603]
R67  4.99R  [R0603]
R68  10R  [R0603]
R69  4.99R  [R0603]
R70  24.9R  [R0603]
R71  49.9R  [R0603]
R72  0R  [R0603]
R73  80R  [R0603]
R74  180R  [R0603]
R75  0R  [R0603]
R76  180R  [R0603]
R77  220R  [R0603]
R78  22R  [R0603]
R79  100K  [R0603]
R80  300K  [R0603]
R81  100K  [R0603]
R82  10K  [R0603]
R83  10K  [R0603]
R84  7.5K  [R0603]
R85  10K  [R0603]
R86  0R  [R0603]
R89  220R  [R0603]
RF1  KH-BNC50-3511  [ANT-TH_KH-BNC50-3511]
RLY2  G6K-2F-Y-DC5  [RELAY-SMD_G6K-2F-Y]
U3  TLP172GM(TPL,E(O  [SMD-4_L4.6-W3.7-P2.54-LS7.0-BR]
U4  GS8091-TR  [SOT-23-5_L3.0-W1.7-P0.95-LS2.8-BR]
U10  CD74HC4051PWR  [TSSOP-16_L5.0-W4.4-P0.65-LS6.4-BL]
U11  GS8091-TR  [SOT-23-5_L3.0-W1.7-P0.95-LS2.8-BR]
U16  LMV321B-TR  [SOT-23-5_L3.0-W1.7-P0.95-LS2.8-BR]
U29  GS8091-TR  [SOT-23-5_L3.0-W1.7-P0.95-LS2.8-BR]
sheet Linker
FPC1  FPC-05F-20PH20  [FPC-SMD_20P-P0.50_XUNPU_FPC-05F-20PH20]
sheet MCU
C4  100nF  [C0603]
C5  100nF  [C0603]
C6  100nF  [C0603]
C7  100nF  [C0603]
C8  100nF  [C0603]
C10  100nF  [C0603]
C11  100nF  [C0603]
C12  100nF  [C0603]
C13  100nF  [C0603]
C14  100nF  [C0603]
C15  100nF  [C0603]
CN1  HC-XH-4AWT  [CONN-SMD_HC-XH-4AWT]
LED3  -  [LED_0805]
R87  10K  [R0603]
SW7  TS36CA-0.6 250gf 031  [SW-SMD_SHOU_TS36CA-0.6]
U2  -  [40*27*11屏蔽盖]
U6  STM32H7B0VBT6  [LQFP-100_L14.0-W14.0-P0.50-LS16.0-BL]
U31  -  [40*27*11屏蔽盖]
X1  25MHz  [OSC-SMD_4P-L3.2-W2.5-BL]
sheet Power
C1  106  [C1206]
C2  106  [C1206]
C16  100nF  [C0603]
C17  100nF  [C0603]
C18  100nF  [C0603]
C19  100nF  [C0603]
C24  106  [C1206]
C42  100nF  [C0603]
C43  100nF  [C0603]
C44  100nF  [C0603]
C47  100nF  [C0603]
C48  100nF  [C0603]
C49  100nF  [C0603]
C50  100nF  [C0603]
C51  100nF  [C0603]
C52  100nF  [C0603]
C53  3.3u  [C0603]
C96  100nF  [C0603]
C97  100nF  [C0603]
C98  100nF  [C0603]
C99  100nF  [C0603]
D1  MBR0520LT3G  [SOD-123_L2.7-W1.6-LS3.7-RD]
L2  4.7uH  [IND-SMD_L7.3-W6.6]
LED1  -  [LED_0805]
LED2  -  [LED_0805]
R1  10K  [R0603]
R2  1K  [R0603]
R3  5.1K  [R0603]
R4  5.1K  [R0603]
R5  20K  [R0603]
R6  20K  [R0603]
R7  10K  [R0603]
R10  10K  [R0603]
R11  10K  [R0603]
R12  10K  [R0603]
R13  10K  [R0603]
SW6  SK12D07VG3  [SW-TH_SK12D07VG3]
U1  MCP73831T-2ATI/OT  [SOT-23-5_L3.0-W1.7-P0.95-LS2.8-BR]
U7  RT9193-33GB  [SOT-23-5_L3.0-W1.7-P0.95-LS2.8-BR]
U8  MP3302DJ-LF-Z  [SOT-23-5_L3.0-W1.7-P0.95-LS2.8-BR]
U19  RT9193-28GB  [SOT-23-5_L3.0-W1.7-P0.95-LS2.8-BR]
U22  RT9193-30GB  [SOT-23-5_L3.0-W1.7-P0.95-LS2.8-BR]
U23  RT9193-33GB  [SOT-23-5_L3.0-W1.7-P0.95-LS2.8-BR]
U24  SGM3204YN6G/TR  [SOT-23-6_L2.9-W1.6-P0.95-LS2.8-BR]
USB1  -  [USB_TYPE-C-16P]
sheet Screen
J2  FPC-40贴片座子/间距0.5MM/上接/抽屉式  [FPC-SMD_40P-P0.50_FPC-40-2]

## Library data of the parts
C1 C2 C20 C24 C25 C60 C61 = CAP_1206: Supplier Footprint: 1206
C4-C8 C10-C19 C28-C44 C47-C53 C62-C68 C73 C76-C89 C94-C99 = CAP_0603: Supplier Footprint: 0603
R1-R7 R10-R13 R17-R44 R47-R89 = Res_0603: Supplier Footprint: 0603
U26 = AD9288BSTZ-40: 接口:并行;采样率:40MHz;分辨率:8位;电源电压:2.7V~3.6V;; Supplier Part: C653455; Manufacturer: ADI(亚德诺); Supplier Footprint: LQFP-48(7x7); JLCPCB Part Class: 扩展库; Datasheet: https://atta.szlcsc.com/upload/public/pdf/source/20140508/1457707057464.pdf; Supplier: LCSC; Interface: 并行; differential input: 是; number of channels: 2; sampling frequency: 40MHz; resolution: 8位; Supply Voltage: 2.7V~3.6V; Operating Temperature: -40℃~+85℃
U27 U28 = TP1961-TR: 比较器（快速，7ns)，推挽输出，特别适合对过压、过流保护要求响应速度快。; Supplier Part: C124557; Manufacturer: 3PEAK; Supplier Footprint: SOT-23-5; JLCPCB Part Class: 扩展库; Supplier: LCSC
U30 = CD74HC4053PW: 开关电路:单刀双掷(SPDT);通道数:3;导通电阻(Ron@VCC):130Ω;; Supplier Part: C1546201; Manufacturer: TI(德州仪器); Supplier Footprint: TSSOP-16; JLCPCB Part Class: 扩展库; Datasheet: https://www.ti.com/cn/lit/gpn/cd74hct4053; Supplier: LCSC; Switch Circuit: 单刀双掷(SPDT); Number of Channels: 3; On-State Resistance (Max): 130Ω; Supply Voltage: 2V~6V
C26 C27 C74 C75 = TZC3Z060AA01R00: 静电容量:2pF~6pF;静电容量公差:0%~+50%;额定电压(Vdc):100V;Q值:500@1MHz;; LCSC Part Name: 2pF~6pF 0%~+50%; Supplier Part: C115494; Manufacturer: muRata(村田); Supplier Footprint: SMD,4.5x3.2mm; JLCPCB Part Class: 扩展库; Datasheet: https://atta.szlcsc.com/upload/public/pdf/source/20170615/1497510908207.pdf; Supplier: LCSC; electrostatic capacity: 2pF~6pF; Tolerance: 0%~+50%; Rated Voltage: 100V; Q @ Freq: 500@1MHz; Operating Temperature: -25℃~+85℃
D2 D3 = 1SS226: LCSC Part Name: 开关二极管; Supplier Part: C779752; Manufacturer: ZRE(治润); Supplier Footprint: SOT-23; JLCPCB Part Class: 扩展库; Supplier: LCSC
Q1 Q2 = CJ2302: 类型:N沟道;漏源电压(Vdss):20V;连续漏极电流(Id):2.1A;功率(Pd):400mW;导通电阻(RDS(on)@Vgs,Id):35mΩ@4.5V,3.6A;; LCSC Part Name: N沟道 耐压:20V 电流:2.1A; Supplier Part: C2910175; Manufacturer: CJ(江苏长电/长晶); Supplier Footprint: SOT-23; JLCPCB Part Class: 扩展库; Datasheet: https://atta.szlcsc.com/upload/public/pdf/source/20211124/46C1BEFE3FB4A4CB9BE8B955105C8A2C.pdf; Supplier: LCSC; Type: N沟道; Drain Source Voltage (Vdss): 20V; Continuous Drain Current (Id): 2.1A; Power Dissipation (Pd): 400mW; Drain Source On Resistance (RDS(on)@Vgs,Id): 35mΩ@4.5V,3.6A; Gate Threshold Voltage (Vgs(th)@Id): 1.2V; Total Gate Charge (Qg@Vgs): 4nC; Input Capacitance (Ciss@Vds): 300pF; Reverse Transfer Capacitance (Crss@Vds): 80pF; Operating Temperature: -55℃~+150℃@(Tj)
RF1 RF3 = KH-BNC50-3511: 连接器类型:板端;射频系列:BNC;接口类型:内孔;端口数量:1;阻抗:50Ω;频率-最大值:3GHz;样式:弯头;接口直径:9.5mm;接口长度/高度:-;工作温度范围:-55℃~+155℃;; LCSC Part Name: BNC 内孔 弯头; Supplier Part: C2837587; Manufacturer: kinghelm(金航标); Supplier Footprint: 插件; JLCPCB Part Class: Extended Part; Datasheet: https://atta.szlcsc.com/upload/public/pdf/source/20221123/AFF24A942BB0EF6B7776F494013BE75C.pdf; Supplier: LCSC; Connector Type: 板端; RF Series: BNC; Interface Type: 内孔; Number of Ports: 1; Impedance: 50Ω; Frequency-Max: 3GHz; Style: 弯头; Interface Diameter: 9.5mm; Operating Temperature Range: -55℃~+155℃
RLY1 RLY2 = G6K-2F-Y-DC5: Supplier Part: C9900017166; Supplier Footprint: G6K_2F_Y_5VDC; JLCPCB Part Class: 扩展库; Datasheet: https://atta.szlcsc.comnull; Supplier: LCSC
U3 U9 = TLP172GM(TPL,E(O: 继电器触点形式:1 Form A(SPST-NO);适用负载类型:AC,DC;正向压降:1.27V;负载电压:350V;连续负载电流:110mA;导通电阻:22Ω;隔离电压:3.75kV;导通时间(Ton):500us;截止时间(Toff):100us;; Supplier Part: C261926; Manufacturer: TOSHIBA(东芝); Supplier Footprint: SOP-4-2.54mm; JLCPCB Part Class: 扩展库; Datasheet: https://atta.szlcsc.com/upload/public/pdf/source/20180801/C261926_98E6F8A0917C7E31AE8EC16F9B9F81C3.pdf; Supplier: LCSC; Relay Contact Form: 1 Form A(SPST-NO); Load Type: AC,DC; Input Forward Voltage: 1.27V; Voltage - Load: 350V; Continuous Load Current: 110mA; On Resistance: 22Ω; Isolation Voltage: 3.75kV; Turn-on time: 500us; Turn-off time: 100us
U4 U11 U12 U15 U18 U29 = GS8091-TR: 运放类型:高速宽带运放;放大器组数:1;增益带宽积（GBP）:180MHz;压摆率（SR）:142/-206 V/us;电源电压:2.5V ~ 5.5V;各通道供电电流:4.2mA;; LCSC Part Name: GS8091 SOT-23-5; Supplier Part: C157724; Manufacturer: Gainsil(聚洵); Supplier Footprint: SOT-23-5; JLCPCB Part Class: 扩展库; Datasheet: https://atta.szlcsc.com/upload/public/pdf/source/20220610/E3748DDE2830B859623FB1BDA24ABCCF.pdf; Supplier: LCSC; Amplifier Type: 高速宽带运放; Number of Circuits: 1; -3db Bandwidth（G=1）: 350MHz; Current - Input Bias（Ib）: 1pA; Voltage - Input Offset（Vos）: 2mV; Gain Bandwidth Product（GBP）: 180MHz; Slew Rate（SR）: 142/-206 V/us; Output Type: 满摆幅; Supply Voltage（Single）: 2.5V ~ 5.5V; Iq per channel (Typ): 4.2mA; Operating Temperature: -40°C ~ 125°C
U10 U14 = CD74HC4051PWR: CD74HC4051 高速 CMOS 8 通道模拟多路复用器和多路信号分离器; Supplier Part: C352826; Manufacturer: TI(德州仪器); Supplier Footprint: TSSOP-16; JLCPCB Part Class: 扩展库; Datasheet: https://atta.szlcsc.com/upload/public/pdf/source/20190717/C352826_0A2DCDFCA6D488CBC5C39996DFE7240E.pdf; Supplier: LCSC
U16 U17 = LMV321B-TR: 增益带宽积（GBP）:1MHz;放大器组数:1;运放类型:CMOS;各通道功耗:130uA;压摆率（SR）:0.7 V/us;电源电压:2.5V ~ 5.5V;; Supplier Part: C248567; Manufacturer: 3PEAK; Supplier Footprint: SOT-23-5; JLCPCB Part Class: 扩展库; Datasheet: https://atta.szlcsc.com/upload/public/pdf/source/20180820/C248567_FB6117AA9E4C198A2BB2FC87F5D06DC7.pdf; Supplier: LCSC
FPC1 = FPC-05F-20PH20: LCSC Part Name: 20P 0.5mm; Supplier Part: C2856803; Manufacturer: XUNPU(讯普); Supplier Footprint: SMD; JLCPCB Part Class: 扩展库; Supplier: LCSC
CN1 = HC-XH-4AWT: 参考系列:-;间距:2.5mm;插针结构:1x4P;排数:1;每排PIN数:4;行距:-;公母:公型插针;安装方式:卧贴;额定电流:3A;工作温度范围:-25℃~+85℃;; LCSC Part Name: 4P卧贴间距P=2.5mm; Supplier Part: C2845685; Manufacturer: HCTL(华灿天禄); Supplier Footprint: SMD,P=2.5mm; JLCPCB Part Class: ExtendedPart; Datasheet: https://atta.szlcsc.com/upload/public/pdf/source/20210728/C2845684_965343274C5A1ED3FF00B3B6BCC0A9E5.pdf; Supplier: LCSC; Pitch: 2.5mm; Pins Structure: 1x4P; Number of Rows: 1; Number of PINs Per Row: 4; Gender: 公型插针; Mounting Style: 卧贴; Current Rating (Max): 3A; Operating Temperature Range: -25℃~+85℃
LED1-LED3 = LED_0805-G: Supplier Footprint: 0805
SW7 = TS36CA-0.6 250gf 031: 触点电流:50mA;额定电压(DC):12V;绝缘电阻:100MΩ;电路结构:单刀单掷;安装方式:卧贴;按钮形状:矩形按钮;按钮/盖帽颜色:黑色;作用力:250gf@±50gf;机械寿命:20000;工作温度:-20℃~+70℃;引脚样式:SMD接片;开关高度:3.5mm;; LCSC Part Name: 轻触开关 3*6*3.5侧按 直径0.6定位柱 白体黑头 250力度; Supplier Part: C2906288; Manufacturer: SHOU HAN(首韩); Supplier Footprint: SMD; JLCPCB Part Class: Extended Part; Datasheet: https://atta.szlcsc.com/upload/public/pdf/source/20211019/6ADEB9DDDDC9A3F33622EA615D016ED7.pdf; Supplier: LCSC; Contact Current: 50mA; Voltage Rating (DC): 12V; Insulation Resistance: 100MΩ; Circuit: 单刀单掷; Mounting Style: 卧贴; Actuator Style: 矩形按钮; Actuator/Cap Color: 黑色; Operating Force: 250gf@±50gf; Mechanical Life: 20000; Operating Temperature: -20℃~+70℃; Pin Style: SMD接片; Switch Height: 3.5mm
U2 U31 = 40*27*11屏蔽罩
U6 = STM32H7B0VBT6: CPU位数:-;ROM类型:-;CPU内核:-;主频（MAX):-;工作电压:-;; Supplier Part: C730227; Manufacturer: ST(意法半导体); Supplier Footprint: LQFP-100; JLCPCB Part Class: Extended Part; Datasheet: https://atta.szlcsc.com/upload/public/pdf/source/20200902/C730225_664883C886B4E760FDC927233147DBDC.pdf; Supplier: LCSC
X1 = CO32H4-25.000-33JDTSN: 频率:25MHz;频率稳定度:±30ppm;工作电压:3.3V;输出模式:HCMOS;工作温度:-40~+85;; LCSC Part Name: 25MHz ±30ppm 3.3V HCMOS; Supplier Part: C2925590; Manufacturer: HCI(杭晶); Supplier Footprint: SMD3225-4P; JLCPCB Part Class: Extended Part; Datasheet: https://atta.szlcsc.com/upload/public/pdf/source/20220525/B926948FC129C170F991EA6FAC6092C6.pdf; Supplier: LCSC; Frequency Stability: ±30ppm; Supply Voltage: 3.3V; Output Type: HCMOS; Operating Temperature: -40~+85
D1 = MBR0520LT3G: 直流反向耐压(Vr):20V;平均整流电流(Io):500mA;正向压降(Vf):385mV@500mA;; Supplier Part: C165467; Manufacturer: onsemi(安森美); Supplier Footprint: SOD-123; JLCPCB Part Class: Extended Part; Datasheet: https://atta.szlcsc.com/upload/public/pdf/source/20200107/C165467_B46770004CC25E9EEC451D5DBE275EFE.pdf; Supplier: LCSC; Reverse Voltage (Vr): 20V; Average Rectified Current (Io): 500mA; Forward Voltage (Vf@If): 385mV@500mA
L2 = MCS0630-2R2MPY1: 电感值:2.2uH;精度:±20%;额定电流:8A;饱和电流(Isat):12A;直流电阻(DCR):17mΩ;; LCSC Part Name: 2.2uH ±20% 8A 17mΩ; Supplier Part: C2937096; Manufacturer: PSA(信昌电陶); Supplier Footprint: 0630; JLCPCB Part Class: Extended Part; Datasheet: https://atta.szlcsc.com/upload/public/pdf/source/20220121/EA6E6E6F70ED7BAE67EC293805EAAACB.pdf; Supplier: LCSC; Tolerance: ±20%; Rated Current: 8A; Saturation Current (Isat): 12A; DC Resistance (DCR): 17mΩ
SW6 = SK12D07VG3: LCSC Part Name: 两档位卧式拨动开关,柄长3MM; Supplier Part: C431547; Manufacturer: SHOU HAN(首韩); Supplier Footprint: 插件; JLCPCB Part Class: Extended Part; Supplier: LCSC
U1 = MCP73831T-2ATI/OT: Tiny 500mA linear charge management controller.  Includes integrated pass transistor, integrated current sensing, and reverse discharge protection in 5-pin SOT-23 and thermally-efficient 8-pin 2mm x 3mm DFN packages; Supplier Part: C14879; Manufacturer: MICROCHIP(美国微芯); Supplier Footprint: SOT-23-5; JLCPCB Part Class: 扩展库; Datasheet: https://atta.szlcsc.com/upload/public/pdf/source/20140724/1457707158941.pdf; Supplier: LCSC
U7 U19 U22 U23 = RT9193-18GB: 输出类型:固定;输出极性:正;输出通道数:1;最大输入电压:5.5V;输出电压:1.8V~1.8V;压差:-;输出电流:300mA;电源纹波抑制比(PRSS):70dB@(100Hz),50dB@(10kHz);; LCSC Part Name: Vin=5.5V Vout=1.8V~1.8V 300mA 70dB@(100Hz),50dB@(10kHz); Supplier Part: C27416; Manufacturer: RICHTEK(台湾立锜); Supplier Footprint: SOT-23-5; JLCPCB Part Class: Extended Part; Datasheet: https://atta.szlcsc.com/upload/public/pdf/source/20140319/1457707024880.pdf; Supplier: LCSC; Output Type: 固定; Output Polarity: 正; Number of Outputs: 1; Maximum Input Voltage: 5.5V; Output Voltage: 1.8V~1.8V; Output Current: 300mA; Power Supply Rejection Ratio (PRSS): 70dB@(100Hz),50dB@(10kHz)
U8 = MP3302DJ-LF-Z: Supplier Part: C15035; Supplier Footprint: SOT-23-5; JLCPCB Part Class: Extended Part; Supplier: LCSC
U24 = SGM3204YN6G/TR: 可输出电流:Up to 200mA;最大输入电压:5.5V;; Supplier Part: C194031; Manufacturer: SGMICRO(圣邦微); Supplier Footprint: SOT-23-6; JLCPCB Part Class: 扩展库; Datasheet: https://atta.szlcsc.com/upload/public/pdf/source/20180627/C194031_755051E53122D645C36CF727711B963E.pdf; Supplier: LCSC; Voltage - Output (Min/Fixed): -1.4V; Voltage - Output (Max): -5.5V; Current - Output: Up to 200mA; Frequency - Switching: 950kHz; Output Type: Adjustable; Voltage - Input (Min): 1.4V; Voltage - Input (Max): 5.5V; Function: Charge Pump; Output Configuration: Negative
USB1 = USB_TYPE-C-16P: Supplier Footprint: SMD
J2 = FPC-40贴片座子/间距0.5MM/上接/抽屉式: Supplier Part: C9900017908; Supplier Footprint: FPC-SMD-40P; JLCPCB Part Class: 扩展库; Datasheet: https://atta.szlcsc.comnull; Supplier: LCSC

## Nets
+2V8: C31.1 C33.1 C34.1 C36.1 C39.1 C43.2 C79.1 C81.1 C82.1 C84.1 C87.1 C94.1 C96.2 C98.2 D2.2(A) D3.2(A) U4.5(VDD) U10.16(VCC) U11.5(VDD) U12.5(VDD) U14.16(VCC) U15.5(VDD) U16.5(+VS) U17.5(+VS) U18.5(VDD) U19.5(VOUT) U24.2(IN) U24.5(EN) U29.5(VDD) U30.16(VCC)
+3V: C48.2 C64.2 C65.2 C66.2 C67.2 C68.2 C73.2 R51.1 R55.1 R59.1 U22.5(VOUT) U26.13(VD) U26.15(VDD) U26.28(VDD) U26.30(VD) U26.31(VD) U26.33(VDD) U26.46(VDD) U26.48(VD) U27.5(V+) U28.5(V+)
+3V3: C4.2 C5.2 C6.2 C7.2 C8.2 C13.2 C14.2 C15.2 C17.2 FPC1.1 FPC1.2 J2.4 J2.31 R7.1 U6.6(VBAT) U6.11(VDD) U6.20(VREF+) U6.21(VDDA) U6.27(VDD) U6.50(VDD) U6.75(VDD) U6.100(VDD) U7.5(VOUT) X1.4(VDD)
+5V: C51.2 RLY1.1 RLY2.1 U23.5(VOUT)
-2V8: C30.1 C32.2 C35.1 C37.1 C38.1 C78.1 C80.2 C83.1 C85.1 C86.1 C95.2 C97.2 C99.2 D2.1(A) D3.1(A) U4.2(VSS) U10.7(VEE) U11.2(VSS) U12.2(VSS) U14.7(VEE) U15.2(VSS) U16.2(-VS) U17.2(-VS) U18.2(VSS) U24.1(OUT) U29.2(VSS) U30.7(VEE)
GND: C1.1 C2.1 C4.1 C5.1 C6.1 C7.1 C8.1 C10.1 C11.1 C12.1 C13.1 C14.1 C15.1 C16.1 C17.1 C18.1 C19.1 C24.1 C26.1 C28.1 C30.2 C31.2 C32.1 C33.2 C34.2 C35.2 C36.2 C37.2 C38.2 C39.2 C40.1 C41.1 C42.1 C43.1 C44.1 C47.1 C48.1 C49.1 C50.1 C51.1 C52.1 C60.1 C61.1 C62.1 C63.1 C64.1 C65.1 C66.1 C67.1 C68.1 C73.1 C74.1 C76.1 C78.2 C79.2 C80.1 C81.2 C82.2 C83.2 C84.2 C85.2 C86.2 C87.2 C88.1 C89.1 C94.2 C95.1 C96.1 C97.1 C98.1 C99.1 CN1.4 CN1.5 CN1.6 FPC1.19 FPC1.20 FPC1.21 FPC1.22 J2.3 J2.5 J2.6 J2.7 J2.13 J2.14 J2.21 J2.22 J2.23 J2.29 J2.36 J2.41 J2.42 LED2.1(C) LED3.1(C) Q1.2(S) Q2.2(S) R2.1 R3.1 R4.1 R6.1 R10.1 R11.1 R12.1 R17.1 R18.1 R21.1 R28.2 R30.1 R33.1 R35.1 R37.1 R42.1 R43.2 R52.1 R61.1 R64.1 R66.2 R73.1 R76.1 R79.1 R84.1 R85.2 RF1.2 RF1.3 RF1.4 RF3.2 RF3.3 RF3.4 SW6.4 SW6.5 SW7.1 U1.2(VSS) U2.1 U6.10(VSS) U6.19(VSSA) U6.26(VSS) U6.49(VSS) U6.74(VSS) U6.94(BOOT0) U6.99(VSS) U7.2(GND) U8.2(GND) U10.6(E#) U10.8(GND) U14.6(E#) U14.8(GND) U19.2(GND) U22.2(GND) U23.2(GND) U24.4(GND) U26.1(GND) U26.12(GND) U26.16(GND) U26.27(GND) U26.29(GND) U26.32(GND) U26.34(GND) U26.45(GND) U27.2(V-) U28.2(V-) U30.6(E#) U30.8(GND) U31.1 USB1.1(EP) USB1.2(EP) USB1.3(EP) USB1.4(EP) USB1.A1(GND) USB1.A12(GND) USB1.B1(GND) USB1.B12(GND) X1.2(GND)
VBAT: C1.2 R5.2 SW6.1 U1.3(VBAT)
VBUS: C2.2 LED1.2(A) SW6.3 U1.4(VDD) USB1.A4(VBUS) USB1.A9(VBUS) USB1.B4(VBUS) USB1.B9(VBUS)
VIN: C16.2 C24.2 C42.2 C47.2 C50.2 L2.1 SW6.2 U7.1(VIN) U7.3(EN) U8.5(IN) U19.1(VIN) U19.3(EN) U22.1(VIN) U22.3(EN) U23.1(VIN) U23.3(EN)
B3: J2.24 U6.67(PA8)
B4: J2.25 U6.42(PE12)
B5: J2.26 U6.25(PA3)
B6: J2.27 U6.77(PA15)
B7: J2.28 U6.96(PB9)
BAT_CH_DET: R1.1 U1.1(STAT)
BL+: C19.2 D1.1(C) J2.2
BL-: J2.1 R11.2 R12.2 U8.3(FB)
CC1: R4.2 USB1.A5(CC1)
CC2: R3.2 USB1.B5(CC2)
CH1_0: R23.1 U12.1(OUT) U12.4(IN-) U14.5(A5)
CH1_1: R23.2 R24.1 U14.4(A7)
CH1_2: R24.2 R25.1 U14.12(A3)
CH1_3: R25.2 R26.1 U14.13(A0)
CH1_4: R26.2 R27.1 U14.14(A1)
CH1_5: R27.2 R28.1 U14.15(A2)
CH1_ADC: R48.1 R54.2 U30.15(BN)
CH1_OUT: R36.2 U30.1(B1) U30.13(A1)
CH2_0: R71.1 U4.1(OUT) U4.4(IN-) U10.5(A5)
CH2_1: R70.1 R71.2 U10.4(A7)
CH2_2: R69.1 R70.2 U10.12(A3)
CH2_3: R68.1 R69.2 U10.13(A0)
CH2_4: R67.1 R68.2 U10.14(A1)
CH2_5: R66.1 R67.2 U10.15(A2)
CH2_ADC: R50.1 R58.2 U30.14(AN)
CH2_OUT: R78.2 U30.2(B0) U30.12(A0)
DA0: U6.55(PD8) U26.37(D0A)
DA1: U6.56(PD9) U26.38(D1A)
DA2: U6.57(PD10) U26.39(D2A)
DA3: U6.58(PD11) U26.40(D3A)
DA4: U6.59(PD12) U26.41(D4A)
DA5: U6.60(PD13) U26.42(D5A)
DA6: U6.61(PD14) U26.43(D6A)
DA7: U6.62(PD15) U26.44(D7A(MSB))
DAC_TRIG: R53.1 R57.1 U6.30(PA6)
DB0: U6.81(PD0) U26.24(D0B)
DB1: U6.82(PD1) U26.23(D1B)
DB2: U6.83(PD2) U26.22(D2B)
DB3: U6.84(PD3) U26.21(D3B)
DB4: U6.85(PD4) U26.20(D4B)
DB5: U6.86(PD5) U26.19(D5B)
DB6: U6.87(PD6) U26.18(D6B)
DB7: U6.88(PD7) U26.17((MSB)D7B)
EC1_A: FPC1.16 U6.22(PA0)
EC1_B: FPC1.17 U6.23(PA1)
EC1_KEY: FPC1.8 U6.3(PE4)
EC2_A: FPC1.4 U6.90(PB4)
EC2_B: FPC1.3 U6.89(PB3)
EC2_KEY: FPC1.9 U6.4(PE5)
EC3_A: FPC1.10 U6.5(PE6)
EC3_B: FPC1.13 U6.13(PH1-OSC_OUT)
EC3_KEY: FPC1.18 U6.24(PA2)
EC4_A: FPC1.14 U6.18(PC3_C)
EC4_B: FPC1.15 U6.47(PB11)
EC4_KEY: FPC1.5 U6.91(PB5)
G2: J2.15 U6.15(PC0)
G3: J2.16 U6.41(PE11)
G4: J2.17 U6.46(PB10)
G5: J2.18 U6.16(PC1)
G6: J2.19 U6.64(PC7)
G7: J2.20 U6.54(PB15)
HC_A1: U6.51(PB12) U14.11(S0)
HC_A2: U6.36(PB2) U10.11(S0)
HC_B1: U6.52(PB13) U14.10(S1)
HC_B2: U6.37(PE7) U10.10(S1)
HC_C1: U6.53(PB14) U14.9(S2)
HC_C2: U6.38(PE8) U10.9(S2)
HC_S0: U6.97(PE0) U30.11(S0)
HC_S1: U6.98(PE1) U30.10(S1)
IO_CLK1: R47.2 U6.39(PE9)
IO_CLK2: R49.1 U6.69(PA10)
IO_OH1: U6.80(PC12) U9.1
IO_OH2: U3.1 U6.7(PC13)
IO_RLY1: Q1.1(G) R43.1 U6.95(PB8)
IO_RLY2: Q2.1(G) R85.1 U6.40(PE10)
IO_S1: U6.1(PE2) U26.8(S1)
IO_S2: U6.2(PE3) U26.9(S2)
LCD_BL: R10.2 R13.1 U6.66(PC9)
LCD_CLK: J2.30 U6.44(PE14)
LCD_DE: J2.34 U6.33(PC5)
LCD_HS: J2.32 U6.63(PC6)
LCD_VS: J2.33 U6.28(PA4)
LED1: R87.2 U6.45(PE15)
OCS_IN: U6.12(PH0-OSC_IN) X1.3(OUT)
OUT_HC1: R29.1 U14.3(A)
OUT_HC2: R72.1 U10.3(A)
PWM_DAC1: R41.1 U6.31(PA7)
PWM_DAC2: R83.1 U6.65(PC8)
R3: J2.8 U6.34(PB0)
R4: J2.9 U6.29(PA5)
R5: J2.10 U6.68(PA9)
R6: J2.11 U6.35(PB1)
R7: J2.12 U6.32(PC4)
REFO: C60.2 C61.2 C62.2 C63.2 U26.3(AINA#) U26.5(REFINA) U26.6(REFOUT) U26.7(REFINB) U26.10(AINB#)
RLY1: R44.2 RLY1.8
RLY2: R86.2 RLY2.8
RST: C12.2 SW7.2 U6.14(NRST)
SWCLK: CN1.3 U6.76(PA14)
SWDIO: CN1.2 U6.72(PA13)
TP_INIT: FPC1.11 U6.8(PC14-OSC32_ON)
TP_RST: FPC1.12 U6.9(PC15-OSC32_OUT)
TP_SCL: FPC1.6 U6.92(PB6)
TP_SDA: FPC1.7 U6.93(PB7)
TRIG1: R56.2 U6.78(PC10)
TRIG2: R60.2 U6.79(PC11)
USB_N: U6.70(PA11) USB1.A7(DN1) USB1.B7(DN2)
USB_P: U6.71(PA12) USB1.A6(DP1) USB1.B6(DP2)
VCAP1: C10.2 U6.48(VCAP)
VCAP2: C11.2 U6.73(VCAP)
VOL_DET: R5.1 R6.2 U6.17(PC2_C)
$1N217: LED1.1(C) R1.2
$1N429: R2.2 U1.5(PROG)
$1N2047: C18.2 U7.4(BP)
$1N2122: LED2.2(A) R7.2
$1N2420: D1.2(A) L2.2 U8.1(SW)
$1N2425: R13.2 U8.4(EN)
$1N4423: C44.2 U19.4(BP)
$1N5394: C49.2 U22.4(BP)
$1N5556: C52.2 U23.4(BP)
$1N5955: C53.1 U24.3(CFLY-)
$1N5960: C53.2 U24.6(CFLY+)
$2N13883: LED3.2(A) R87.1
$4N314: C25.1 RF3.1(OUT) U9.4
$4N817: R19.1 R20.2
$4N917: C25.2 C26.2 C27.2 C29.2 R19.2 R22.2 U9.3
$4N1166: C27.1 C28.2 R20.1 R21.2 RLY1.2
$4N1175: C29.1 R22.1 RLY1.4
$4N2233: D2.3(K) RLY1.3 U12.3(IN+)
$4N3617: R29.2 U15.3(IN+)
$4N3698: R30.2 R31.1 U15.4(IN-)
$4N4403: R32.2 U18.3(IN+)
$4N4525: R34.2 R36.1 U18.1(OUT)
$4N4532: R31.2 R32.1 U15.1(OUT)
$4N4643: R37.2 U17.1(IN+)
$4N5015: R38.1 R39.2 U17.3(IN-)
$4N5211: C40.2 R40.1 R41.2
$4N5218: C41.2 R39.1 R40.2 R42.2
$4N5500: Q1.3(D) R44.1
$4N10904: R33.2 R34.1 R88.2 U18.4(IN-)
$4N10910: R38.2 R88.1 U17.4(OUT)
$4N14248: R17.2 R18.2 U9.2
$5N377: R48.2 U26.2(AINA)
$5N400: R50.2 U26.11(AINB)
$5N406: R49.2 U26.14(ENCB)
$5N596: R47.1 U26.47(ENCA)
$5N1044: R51.2 R52.2 U26.4(DFS)
$5N1500: R53.2 U27.4(-IN)
$5N1522: R54.1 U27.3(+IN)
$5N1777: R55.2 R56.1 U27.1(OUT)
$5N1990: R57.2 U28.4(-IN)
$5N2007: R58.1 U28.3(+IN)
$5N2009: R59.2 R60.1 U28.1(OUT)
$7N314: C20.1 RF1.1(OUT) U3.4
$7N817: R62.1 R63.2
$7N917: C20.2 C74.2 C75.2 C77.2 R62.2 R65.2 U3.3
$7N1166: C75.1 C76.2 R63.1 R64.2 RLY2.2
$7N1175: C77.1 R65.1 RLY2.4
$7N2233: D3.3(K) RLY2.3 U4.3(IN+)
$7N3617: R72.2 U11.3(IN+)
$7N3698: R73.2 R74.1 U11.4(IN-)
$7N4403: R75.2 U29.3(IN+)
$7N4525: R77.2 R78.1 U29.1(OUT)
$7N4532: R74.2 R75.1 U11.1(OUT)
$7N4643: R79.2 U16.1(IN+)
$7N5015: R80.1 R81.2 U16.3(IN-)
$7N5211: C88.2 R82.1 R83.2
$7N5218: C89.2 R81.1 R82.2 R84.2
$7N5500: Q2.3(D) R86.1
$7N12972: R80.2 R89.1 U16.4(OUT)
$7N12980: R76.2 R77.1 R89.2 U29.4(IN-)
$7N16340: R35.2 R61.2 U3.2

Not connected (* = marked no-connect by the designer): CN1 1; J2 35* 37* 38* 39* 40*; RLY1 5* 6* 7*; RLY2 5* 6* 7*; SW7 3 4; U6 43(PE13)*; U10 1(A4)* 2(A6)*; U14 1(A4)* 2(A6)*; U26 25(NC)* 26(NC)* 35(NC)* 36(NC)*; U30 3(C1)* 4(CN)* 5(C0)* 9(S2)*; USB1 A8(SBUS1)* B8(SBUS2)*; X1 1(OE/NC)*

## Notes on the sheets
sheet 1
- DC IN
- Baterry Management
- Power Convert
sheet 2
- PC0     ------> LTDC_G2
  PC1     ------> LTDC_G5
  PA3     ------> LTDC_B5
  PA4     ------> LTDC_VSYNC
  PA5     ------> LTDC_R4
  PC4     ------> LTDC_R7
  PC5     ------> LTDC_DE
  PB0     ------> LTDC_R3
  PB1     ------> LTDC_R6
  PE11     ------> LTDC_G3
  PE12     ------> LTDC_B4
  PE14     ------> LTDC_CLK
  PB10     ------> LTDC_G4
  PB15     ------> LTDC_G7
  PA8     ------> LTDC_B3
  PC6     ------> LTDC_HSYNC
  PC7     ------> LTDC_G6
  PA9     ------> LTDC_R5
  PA15     ------> LTDC_B6
  PB9     ------> LTDC_B7
sheet 5
- DFS低电平二进制输出，高电平二进制补码输出
